# EAGLE schematic 96_Parallelism_DB_Yamaichi_Rev1.2 (EAGLE 9.5.2)
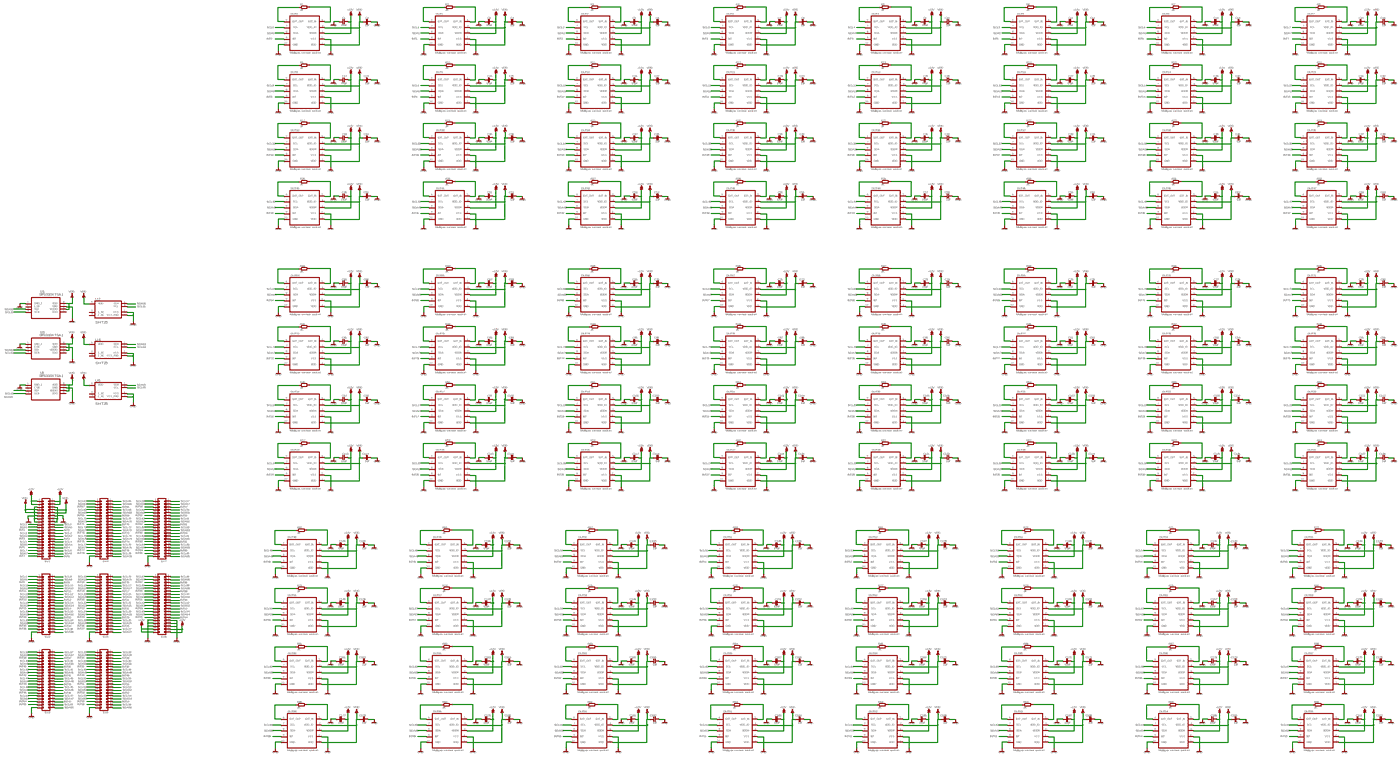
[diagram p0: schematic, sheet 1, overview]
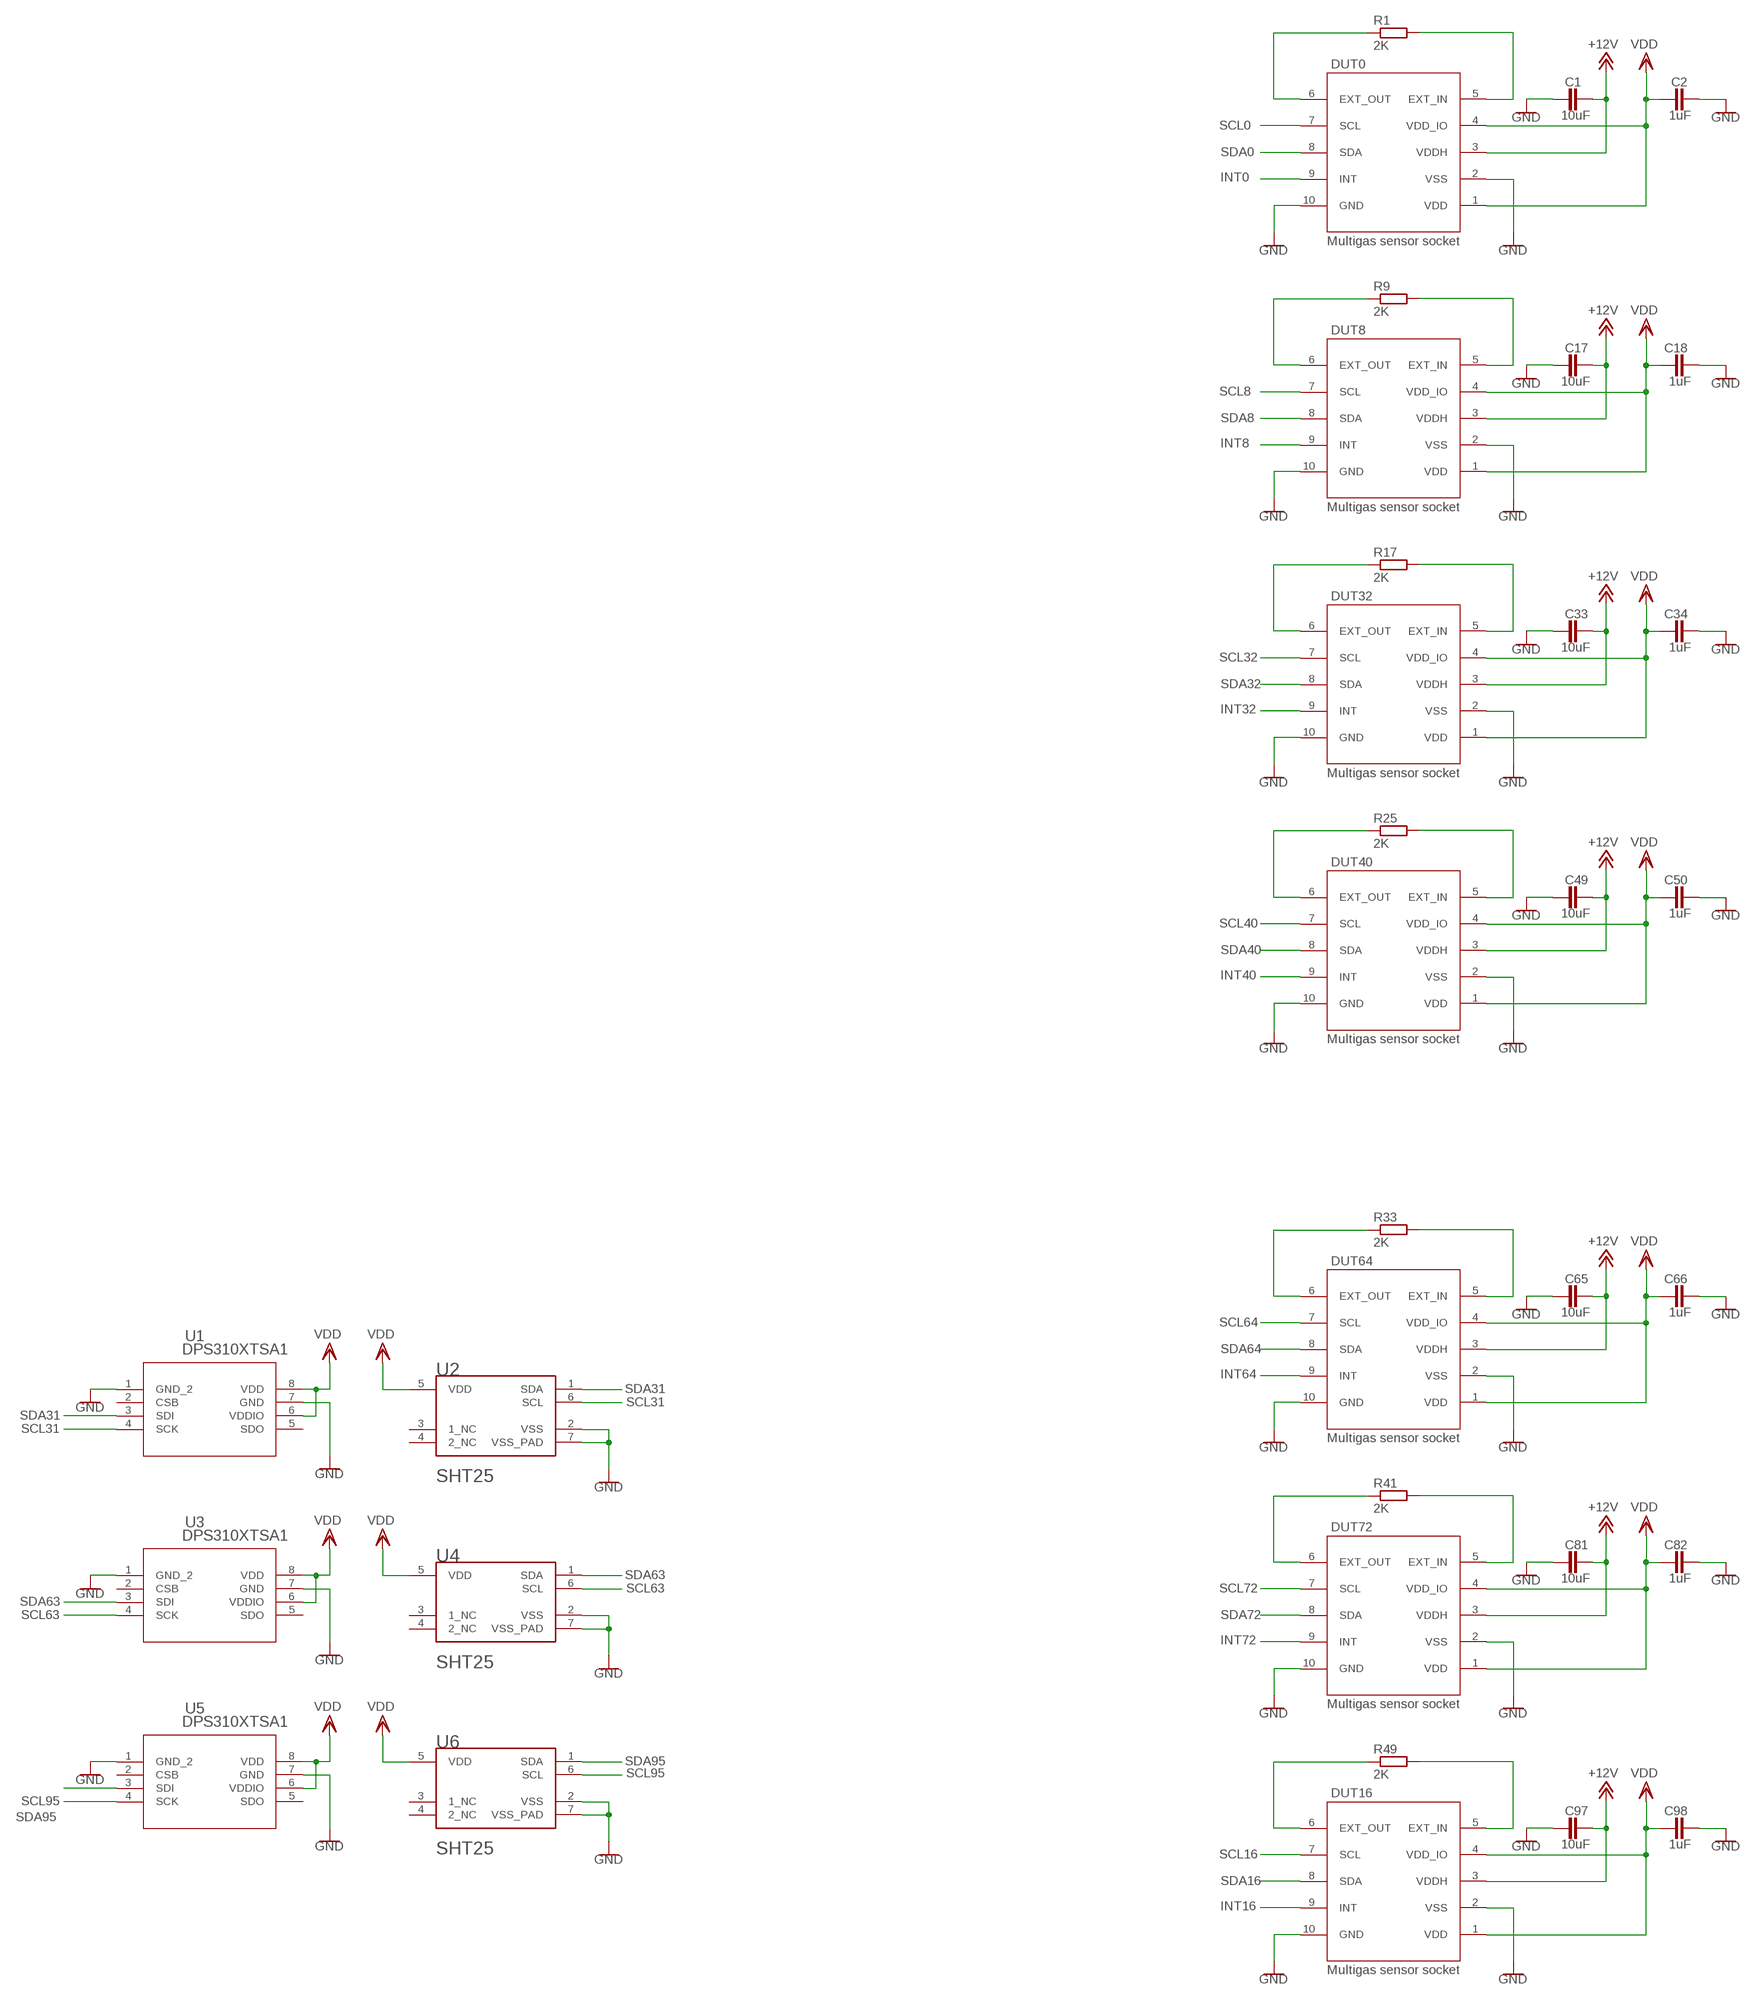
[diagram p1: schematic, sheet 1, part 1 of 8]
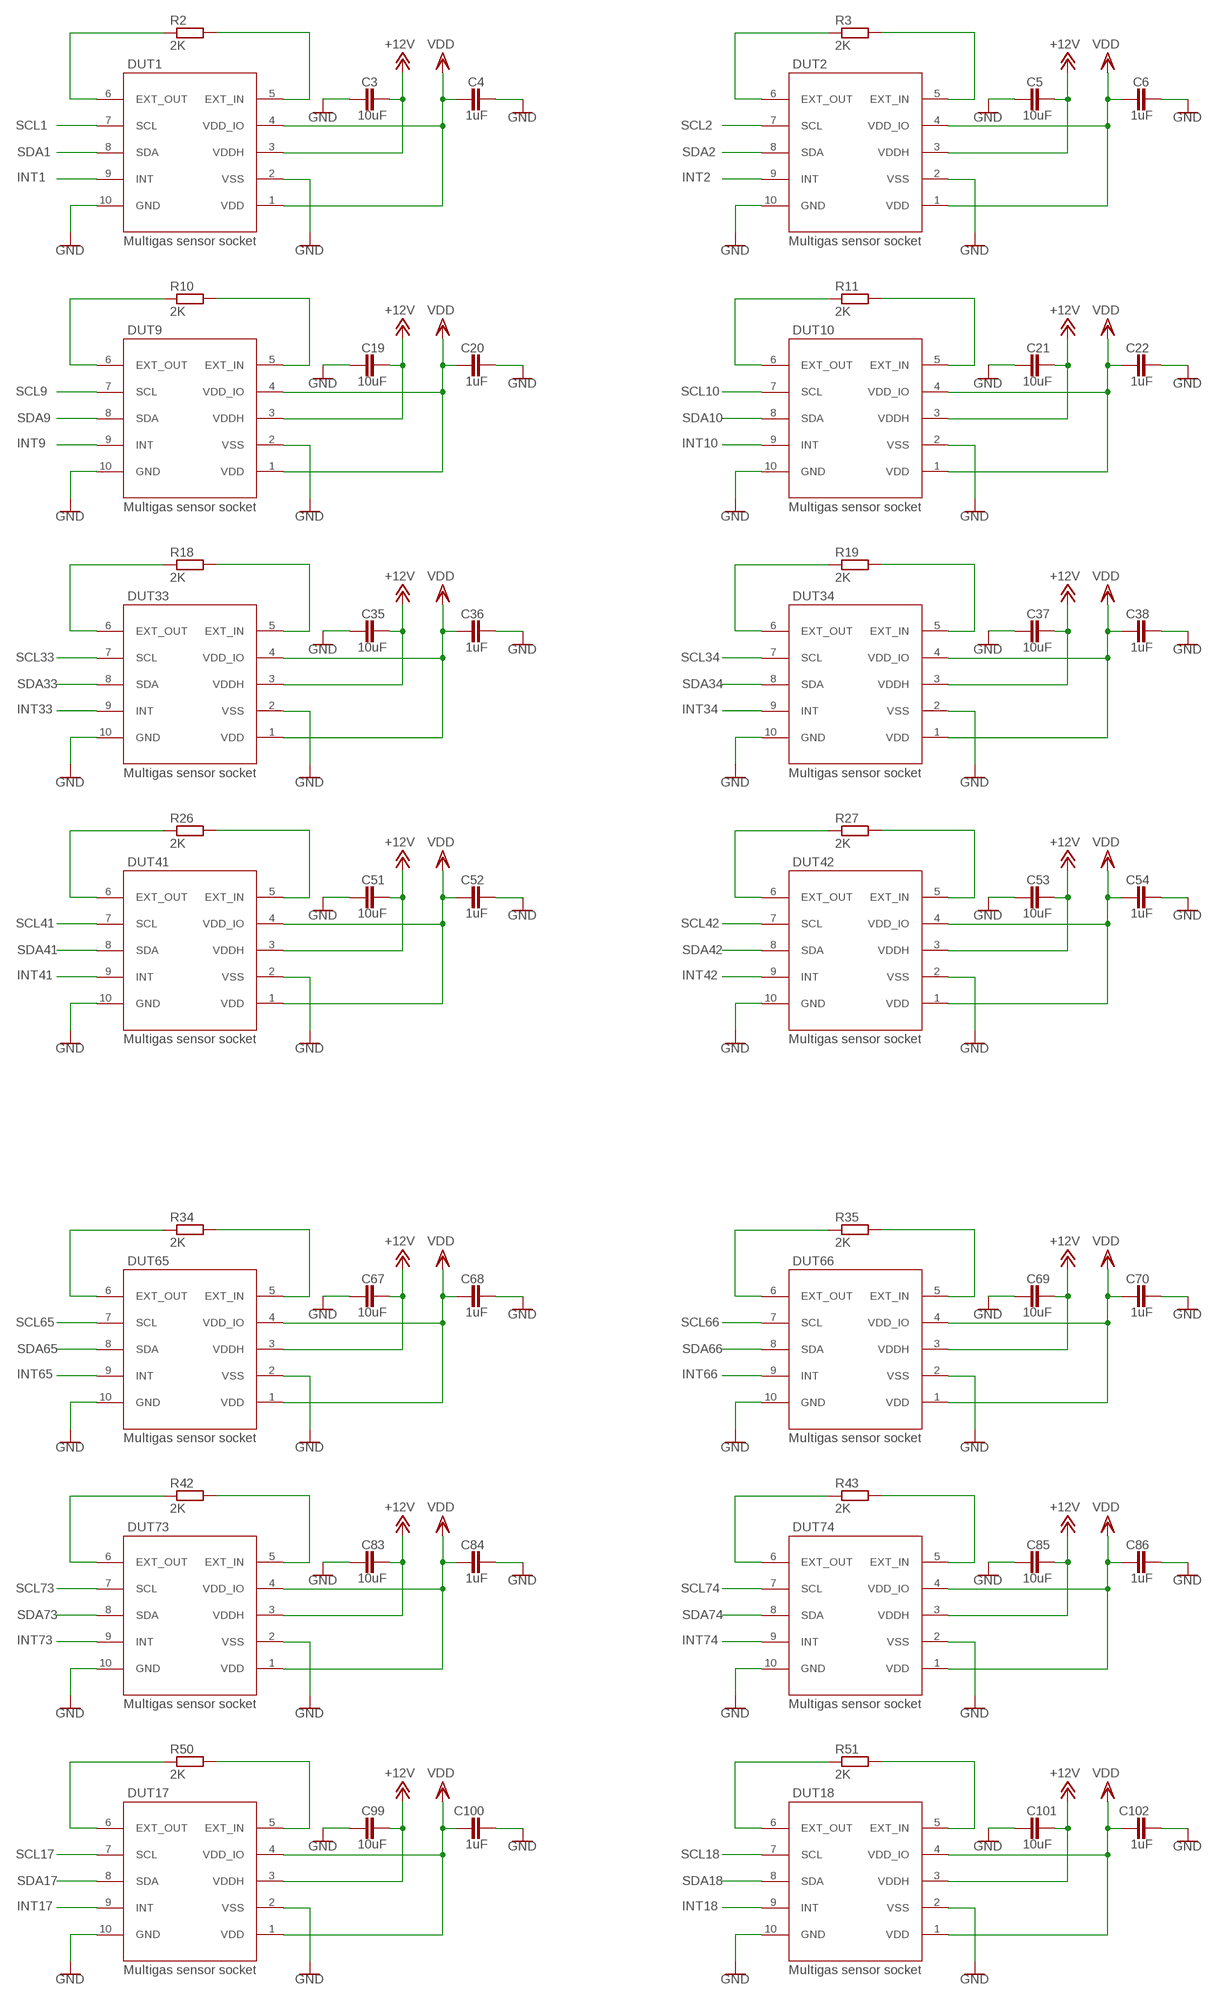
[diagram p2: schematic, sheet 1, part 2 of 8]
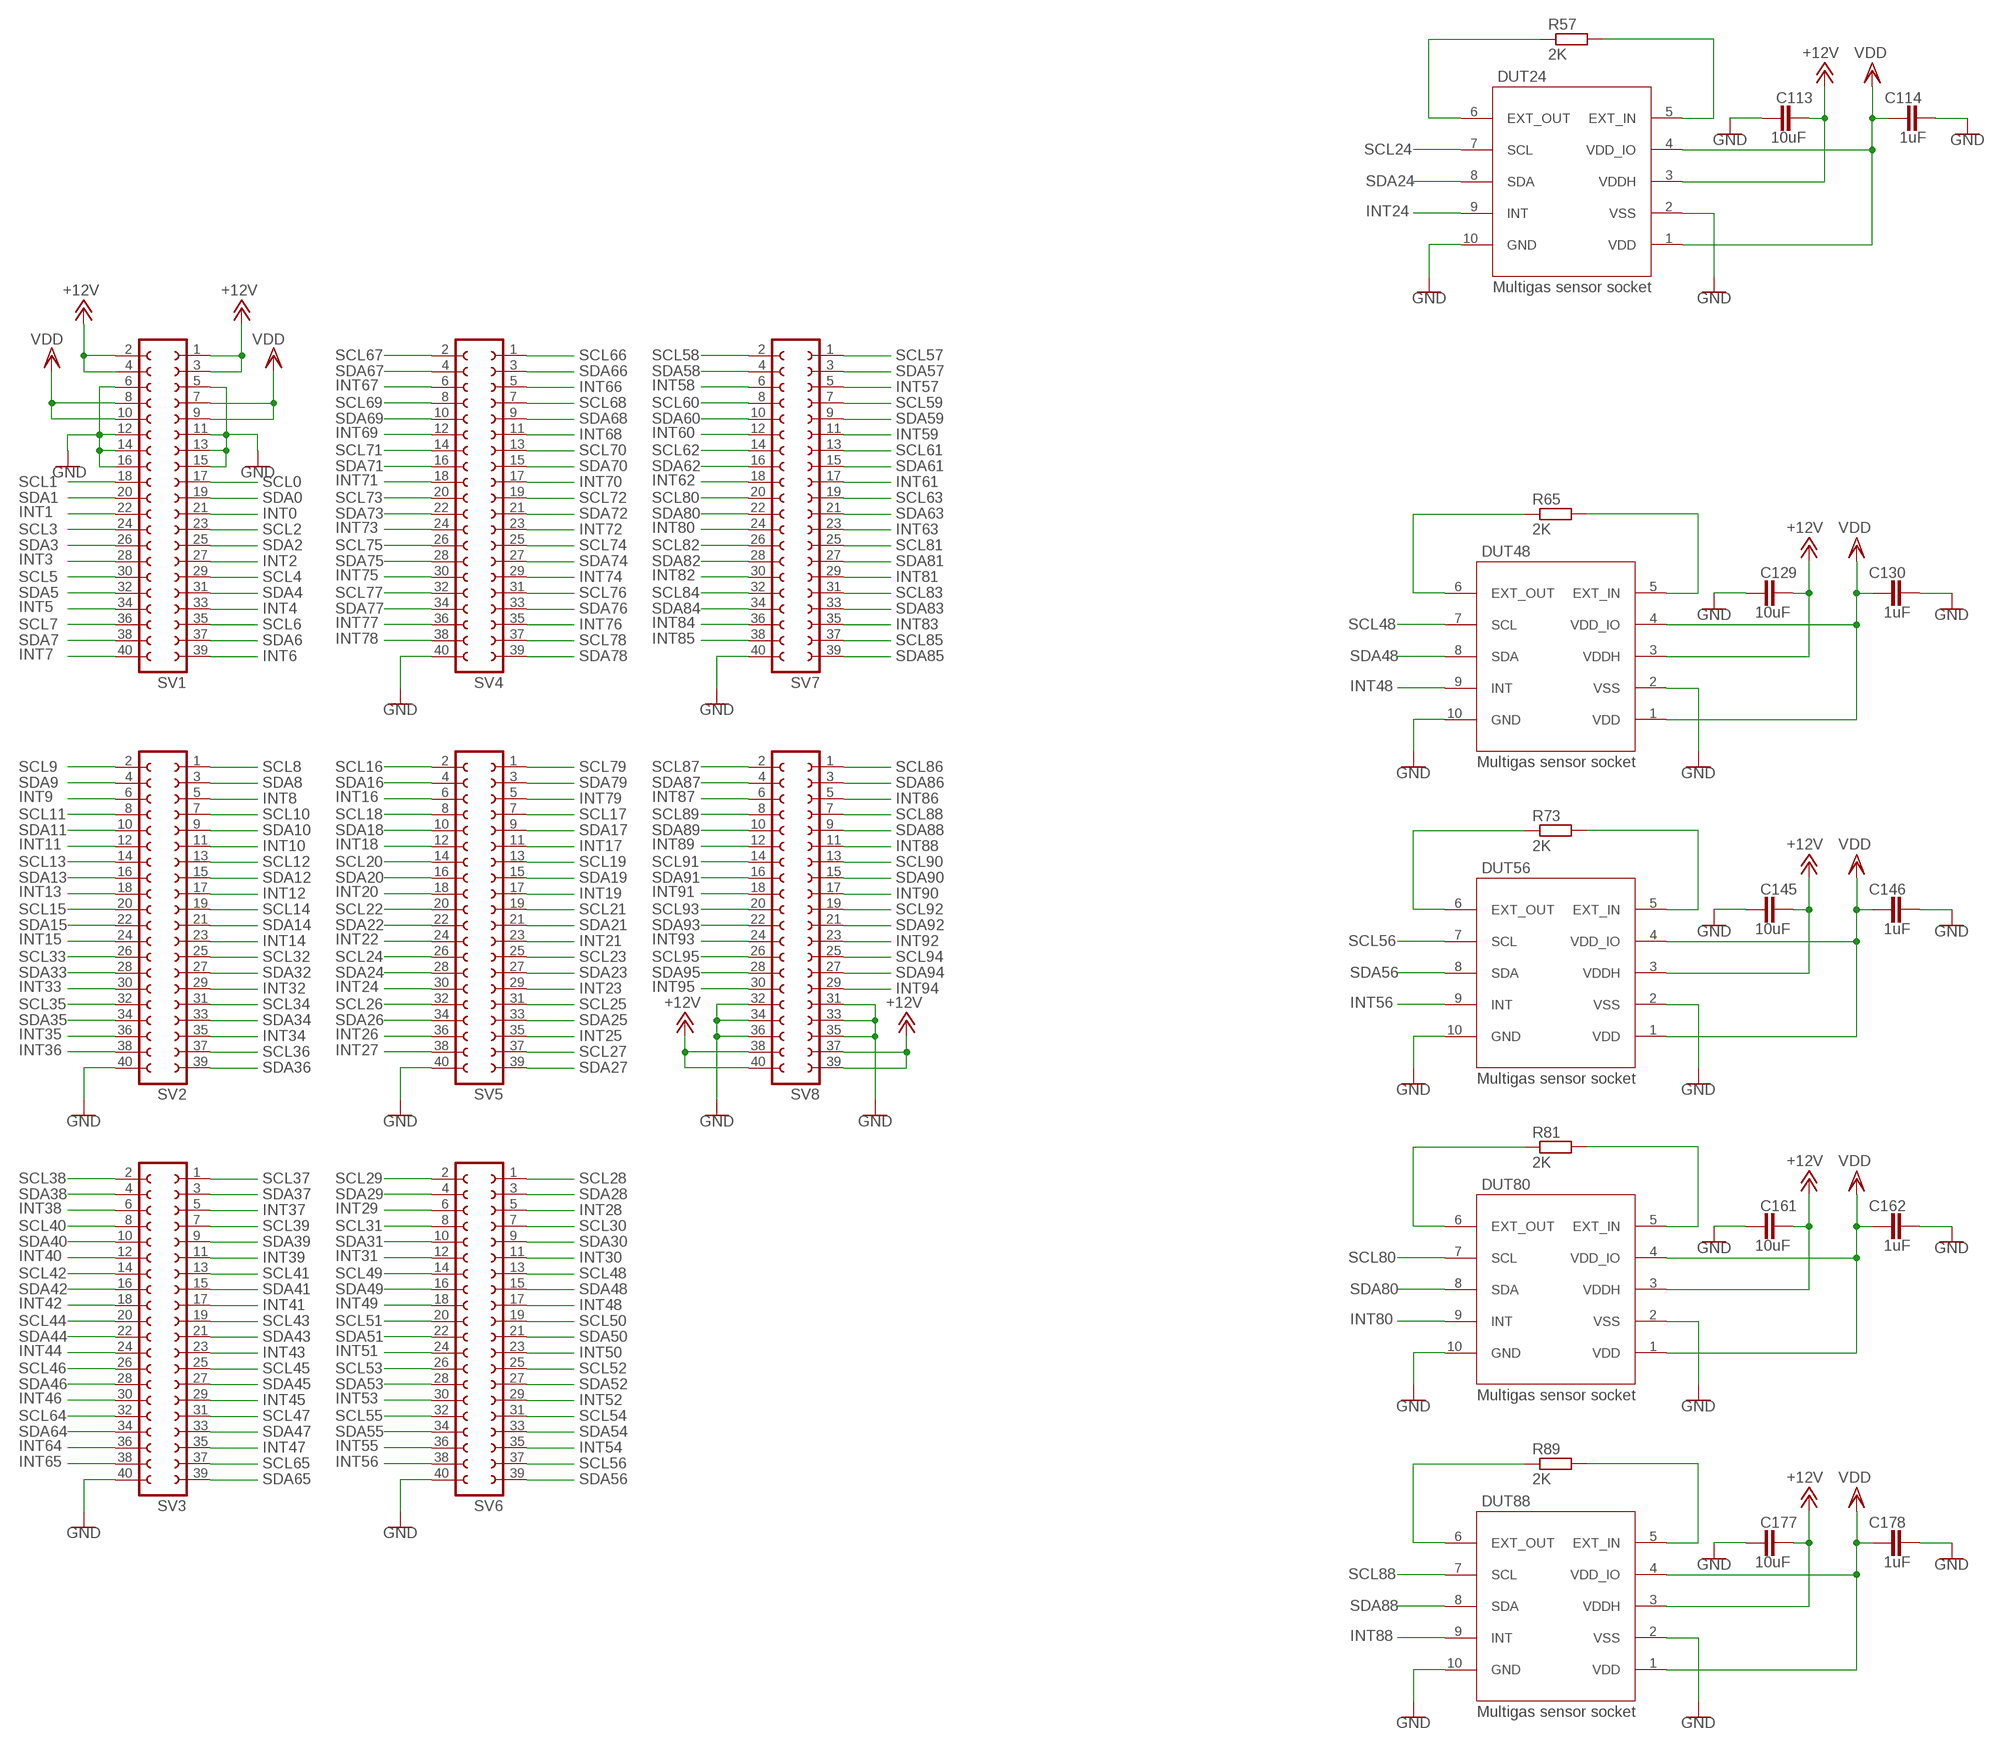
[diagram p3: schematic, sheet 1, part 3 of 8]
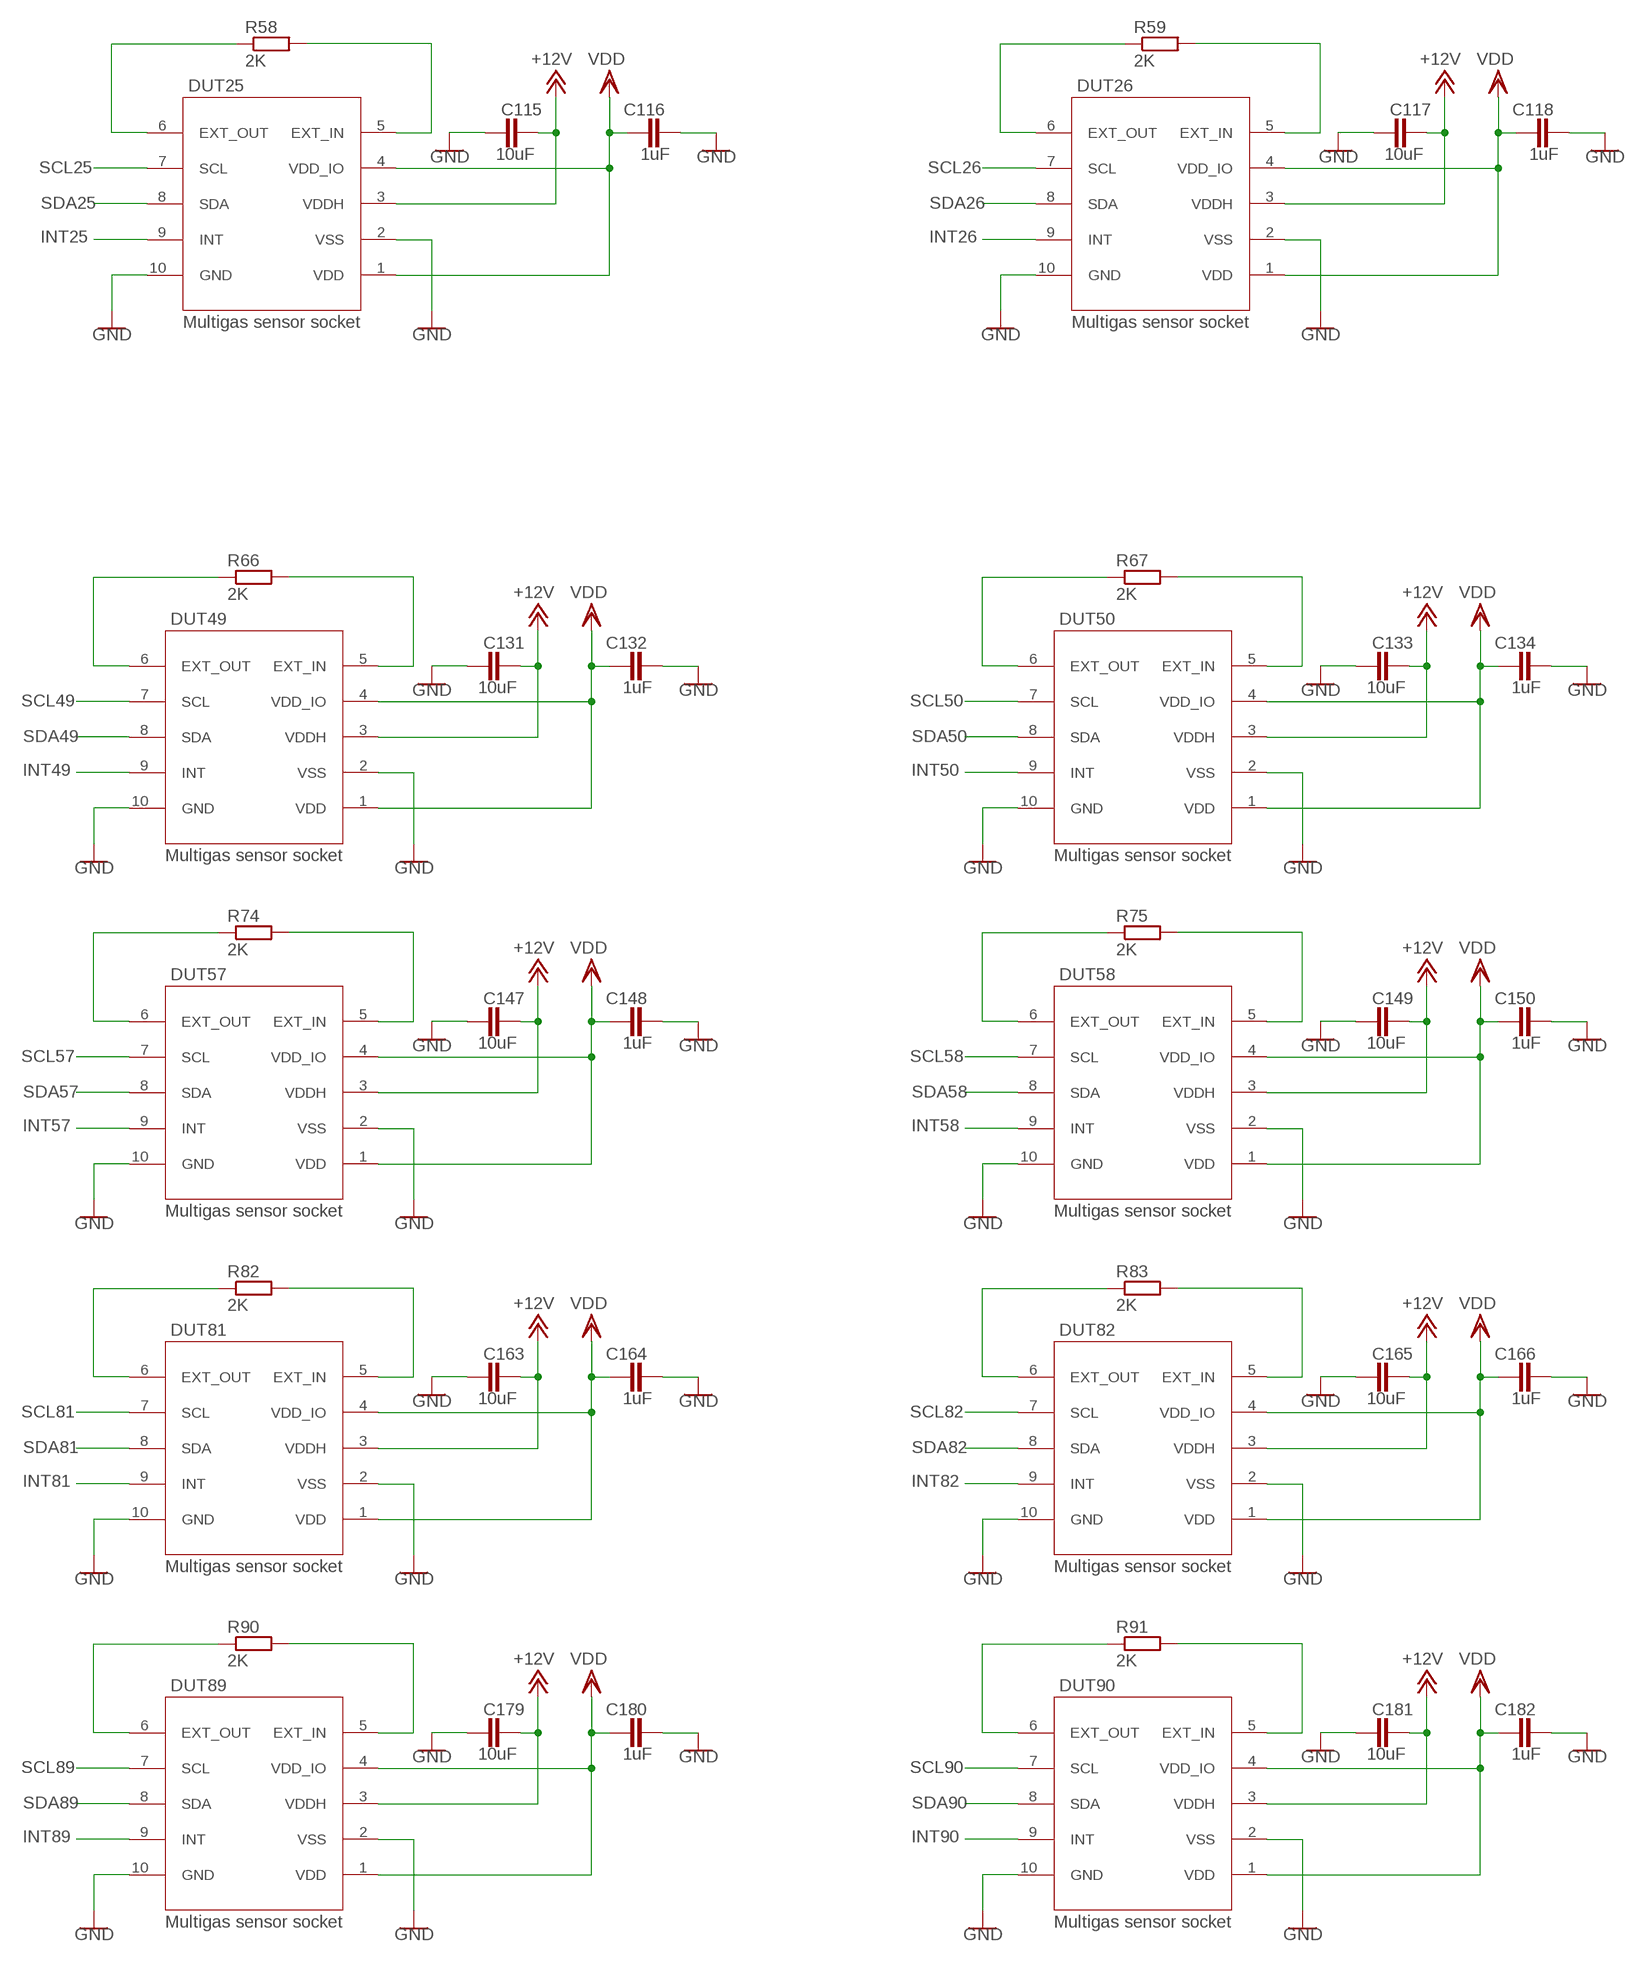
[diagram p4: schematic, sheet 1, part 4 of 8]
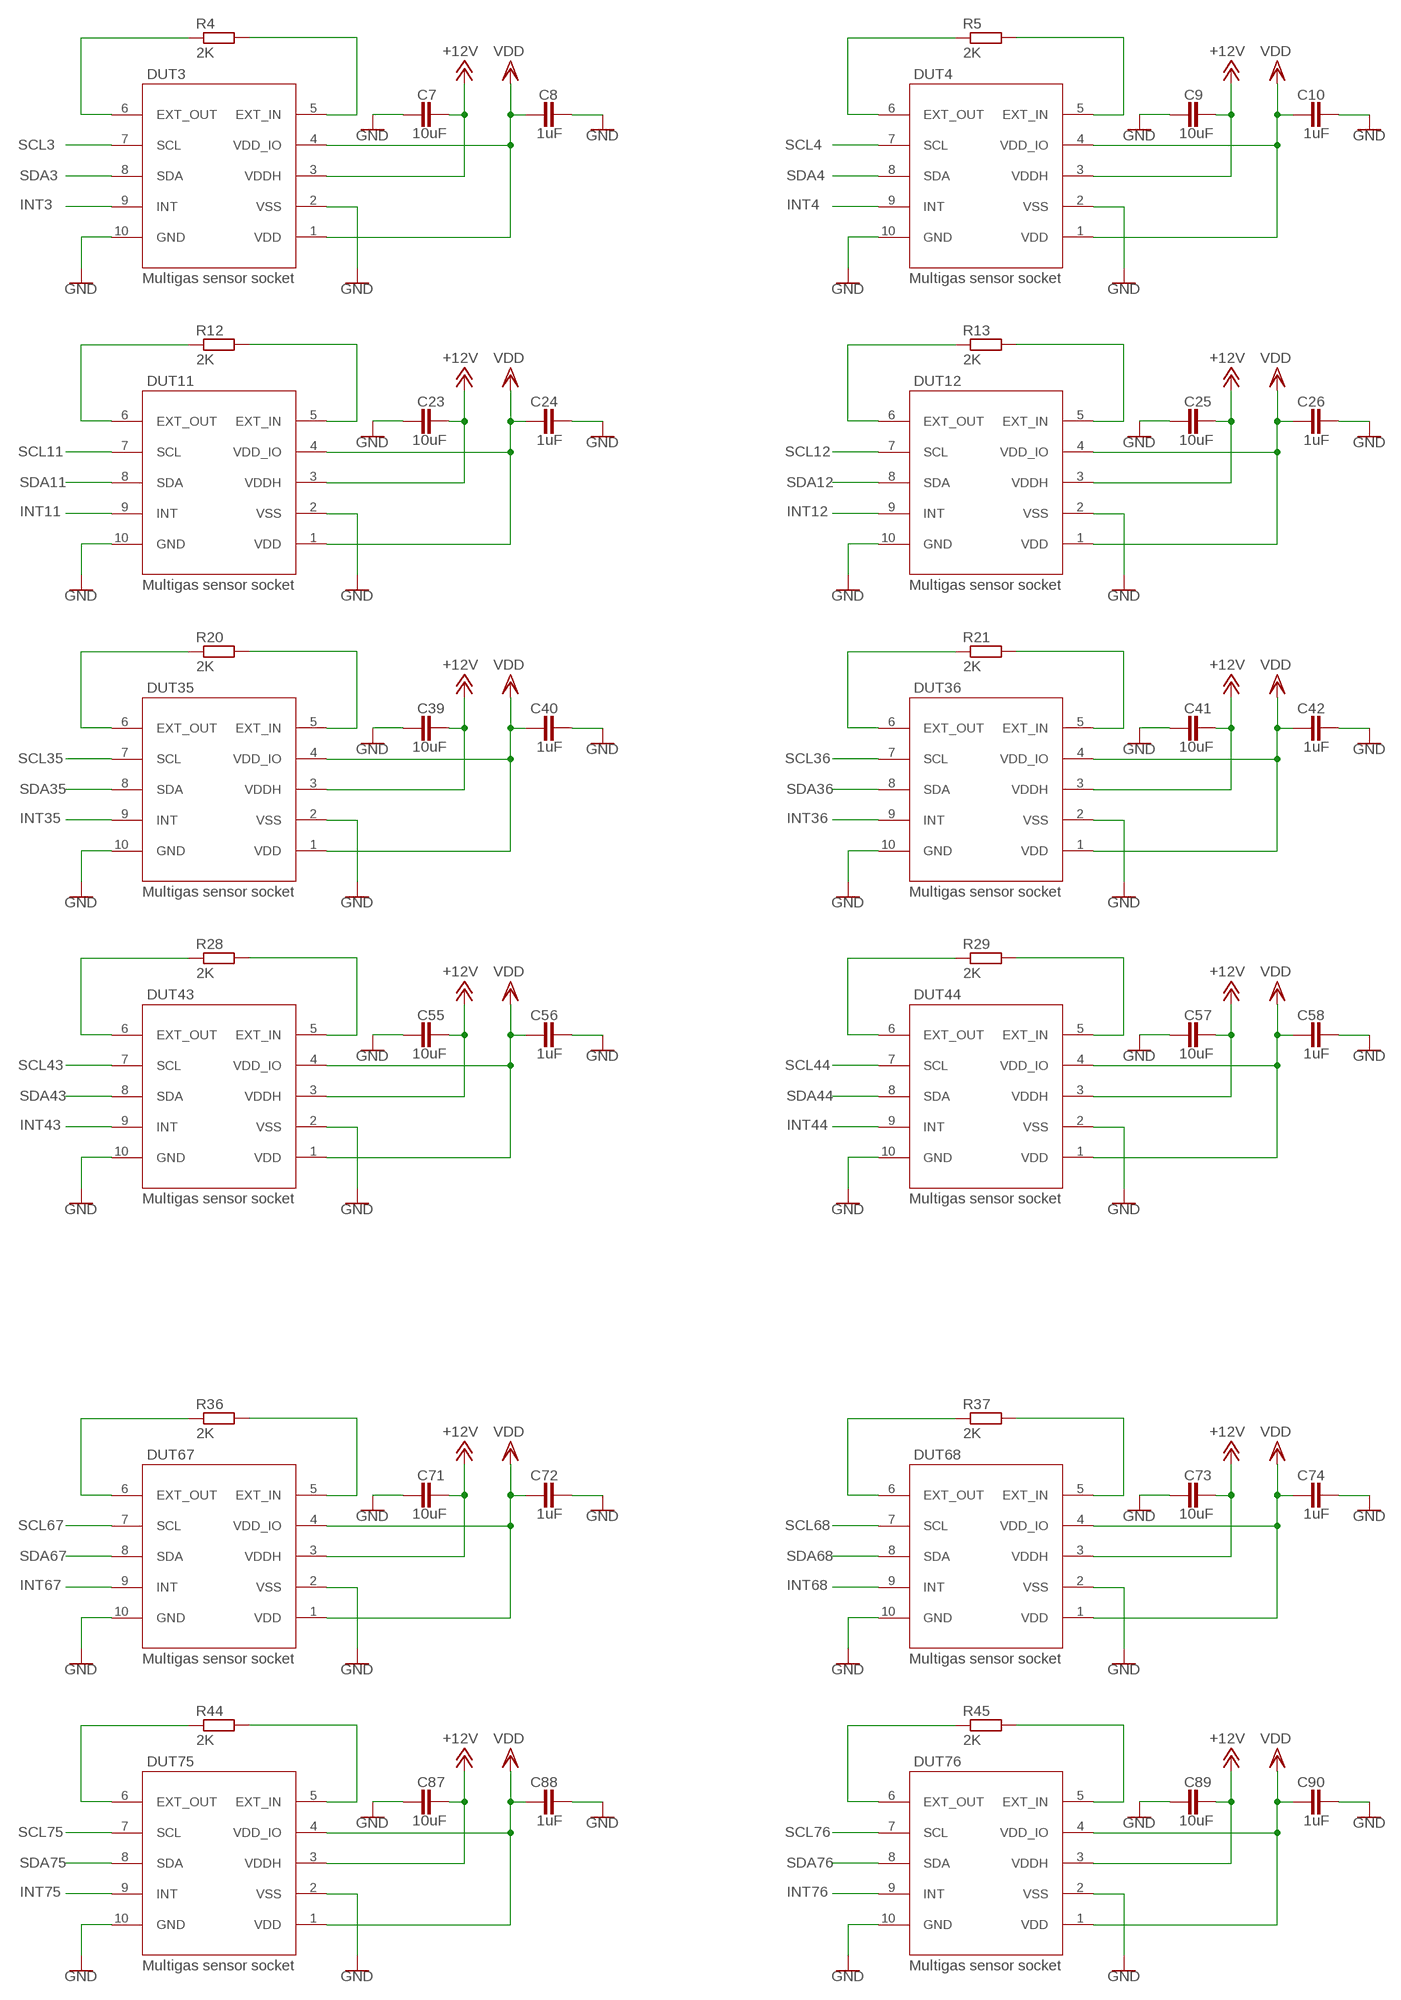
[diagram p5: schematic, sheet 1, part 5 of 8]
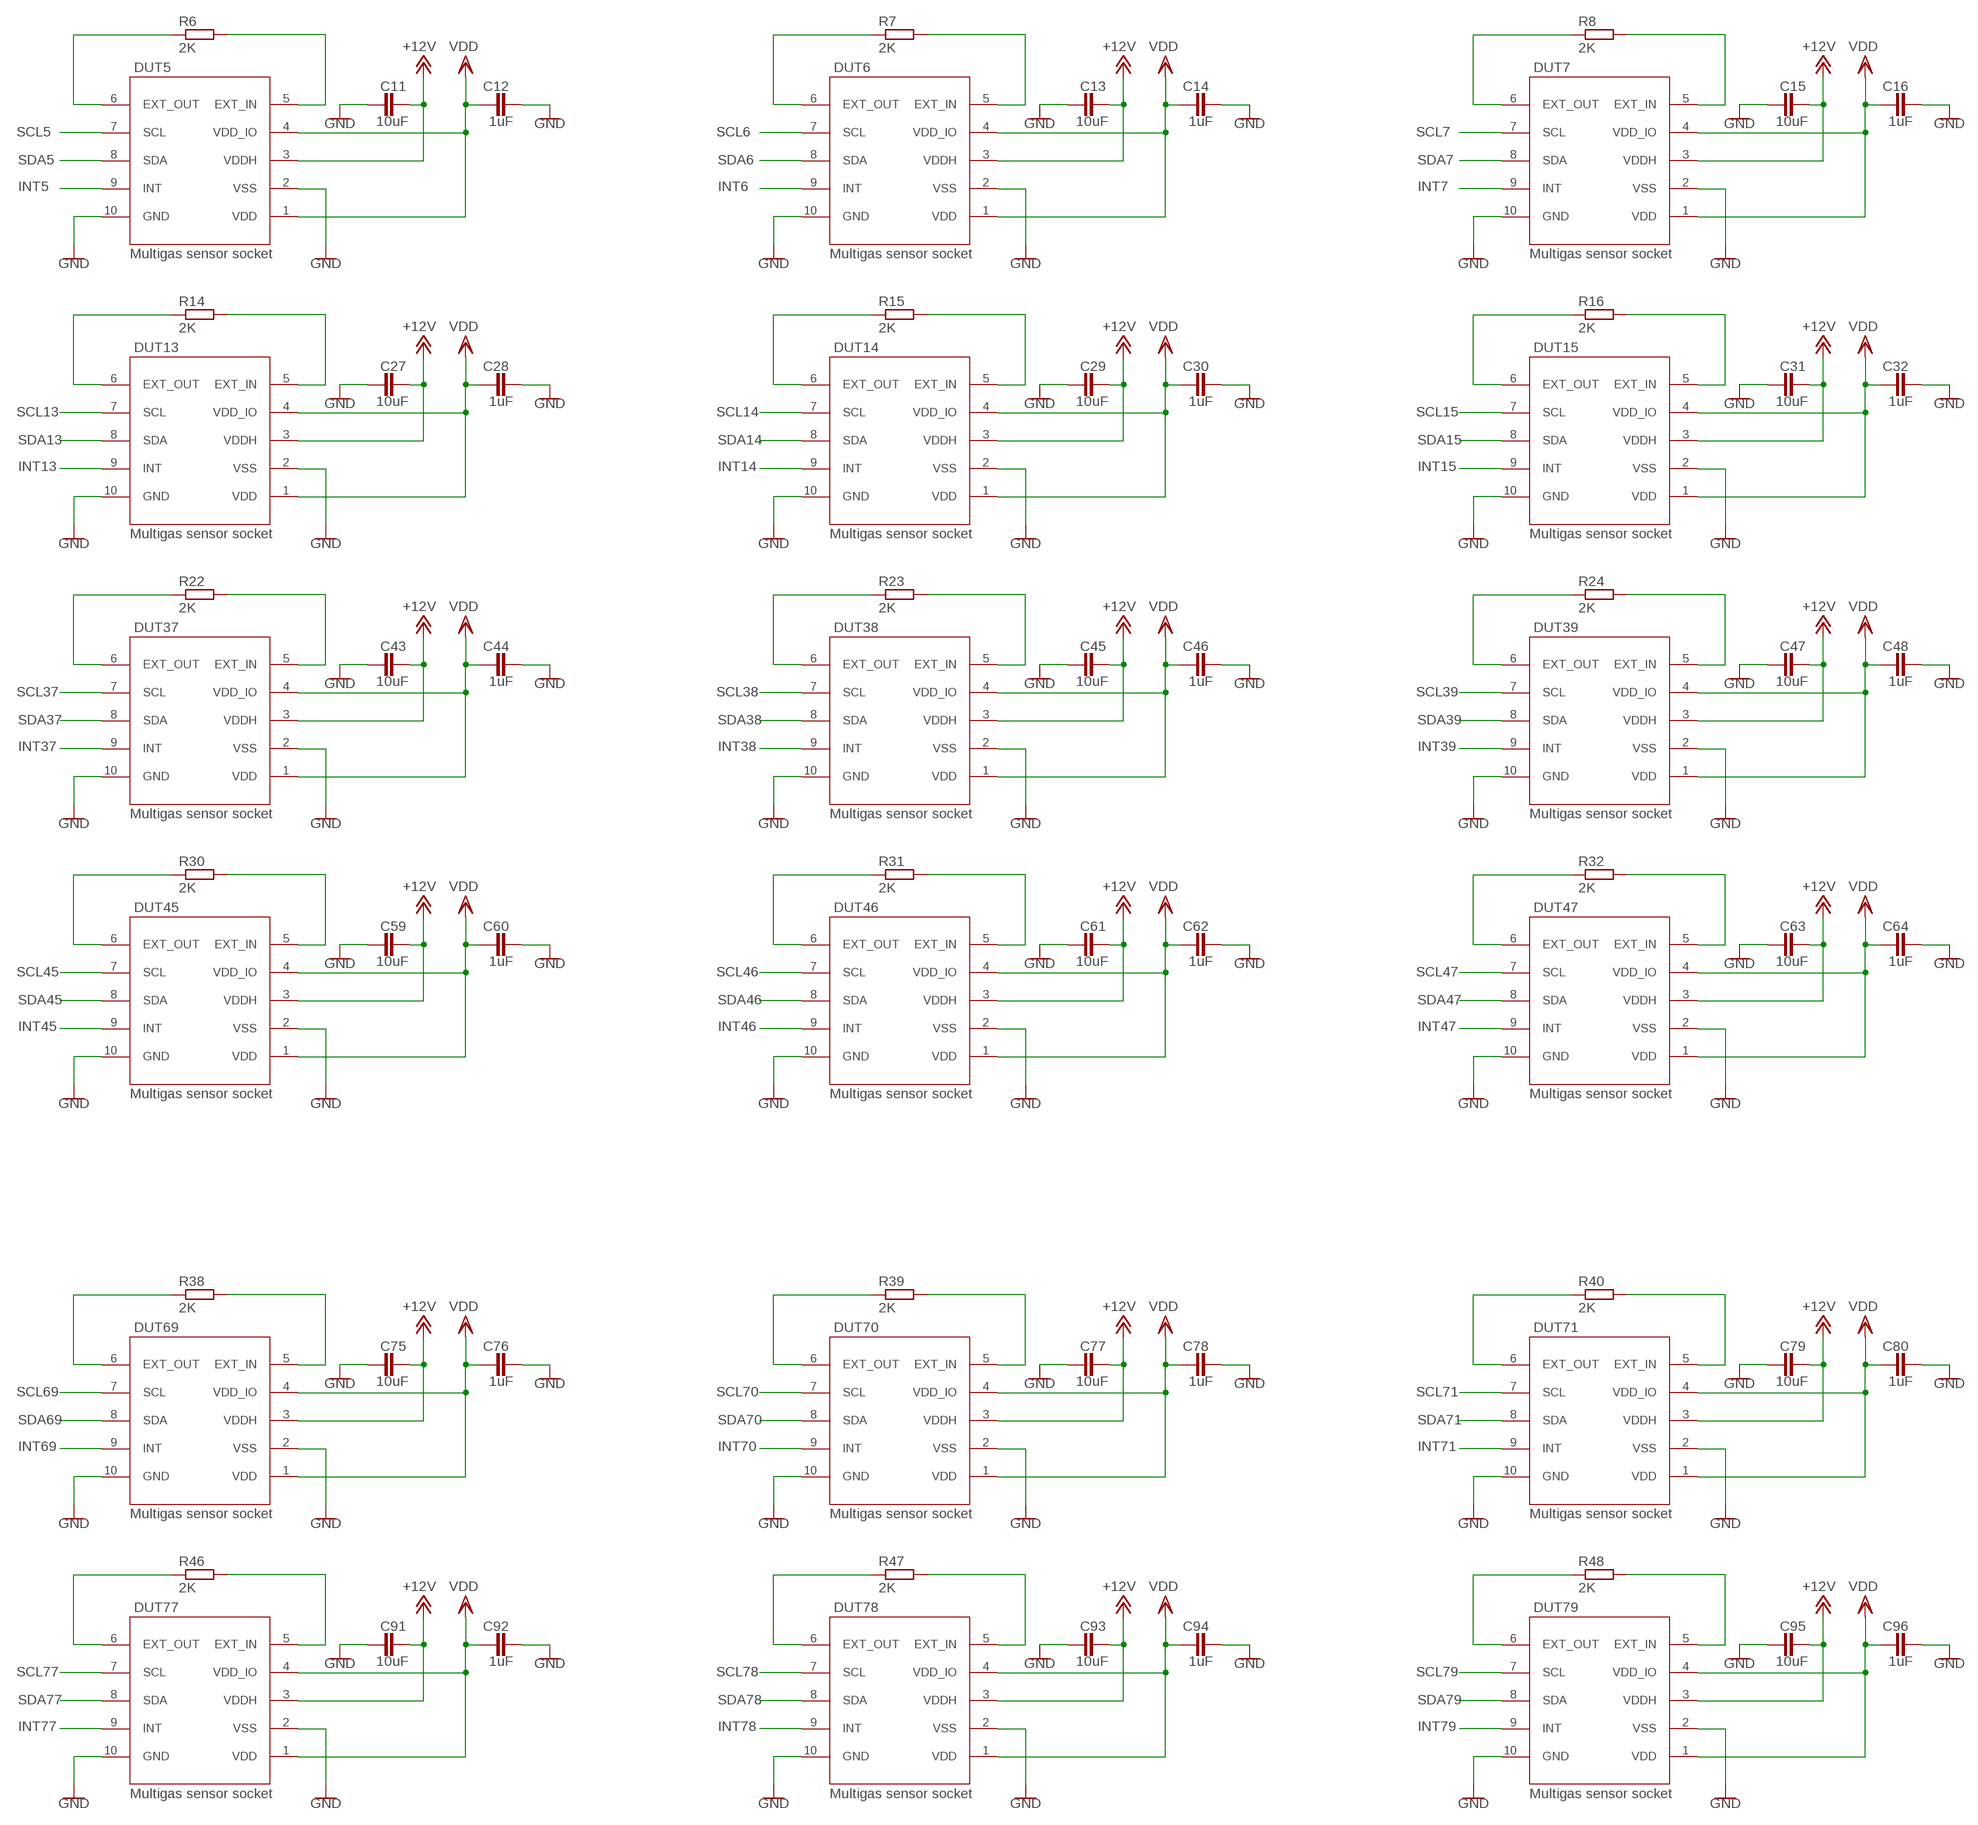
[diagram p6: schematic, sheet 1, part 6 of 8]
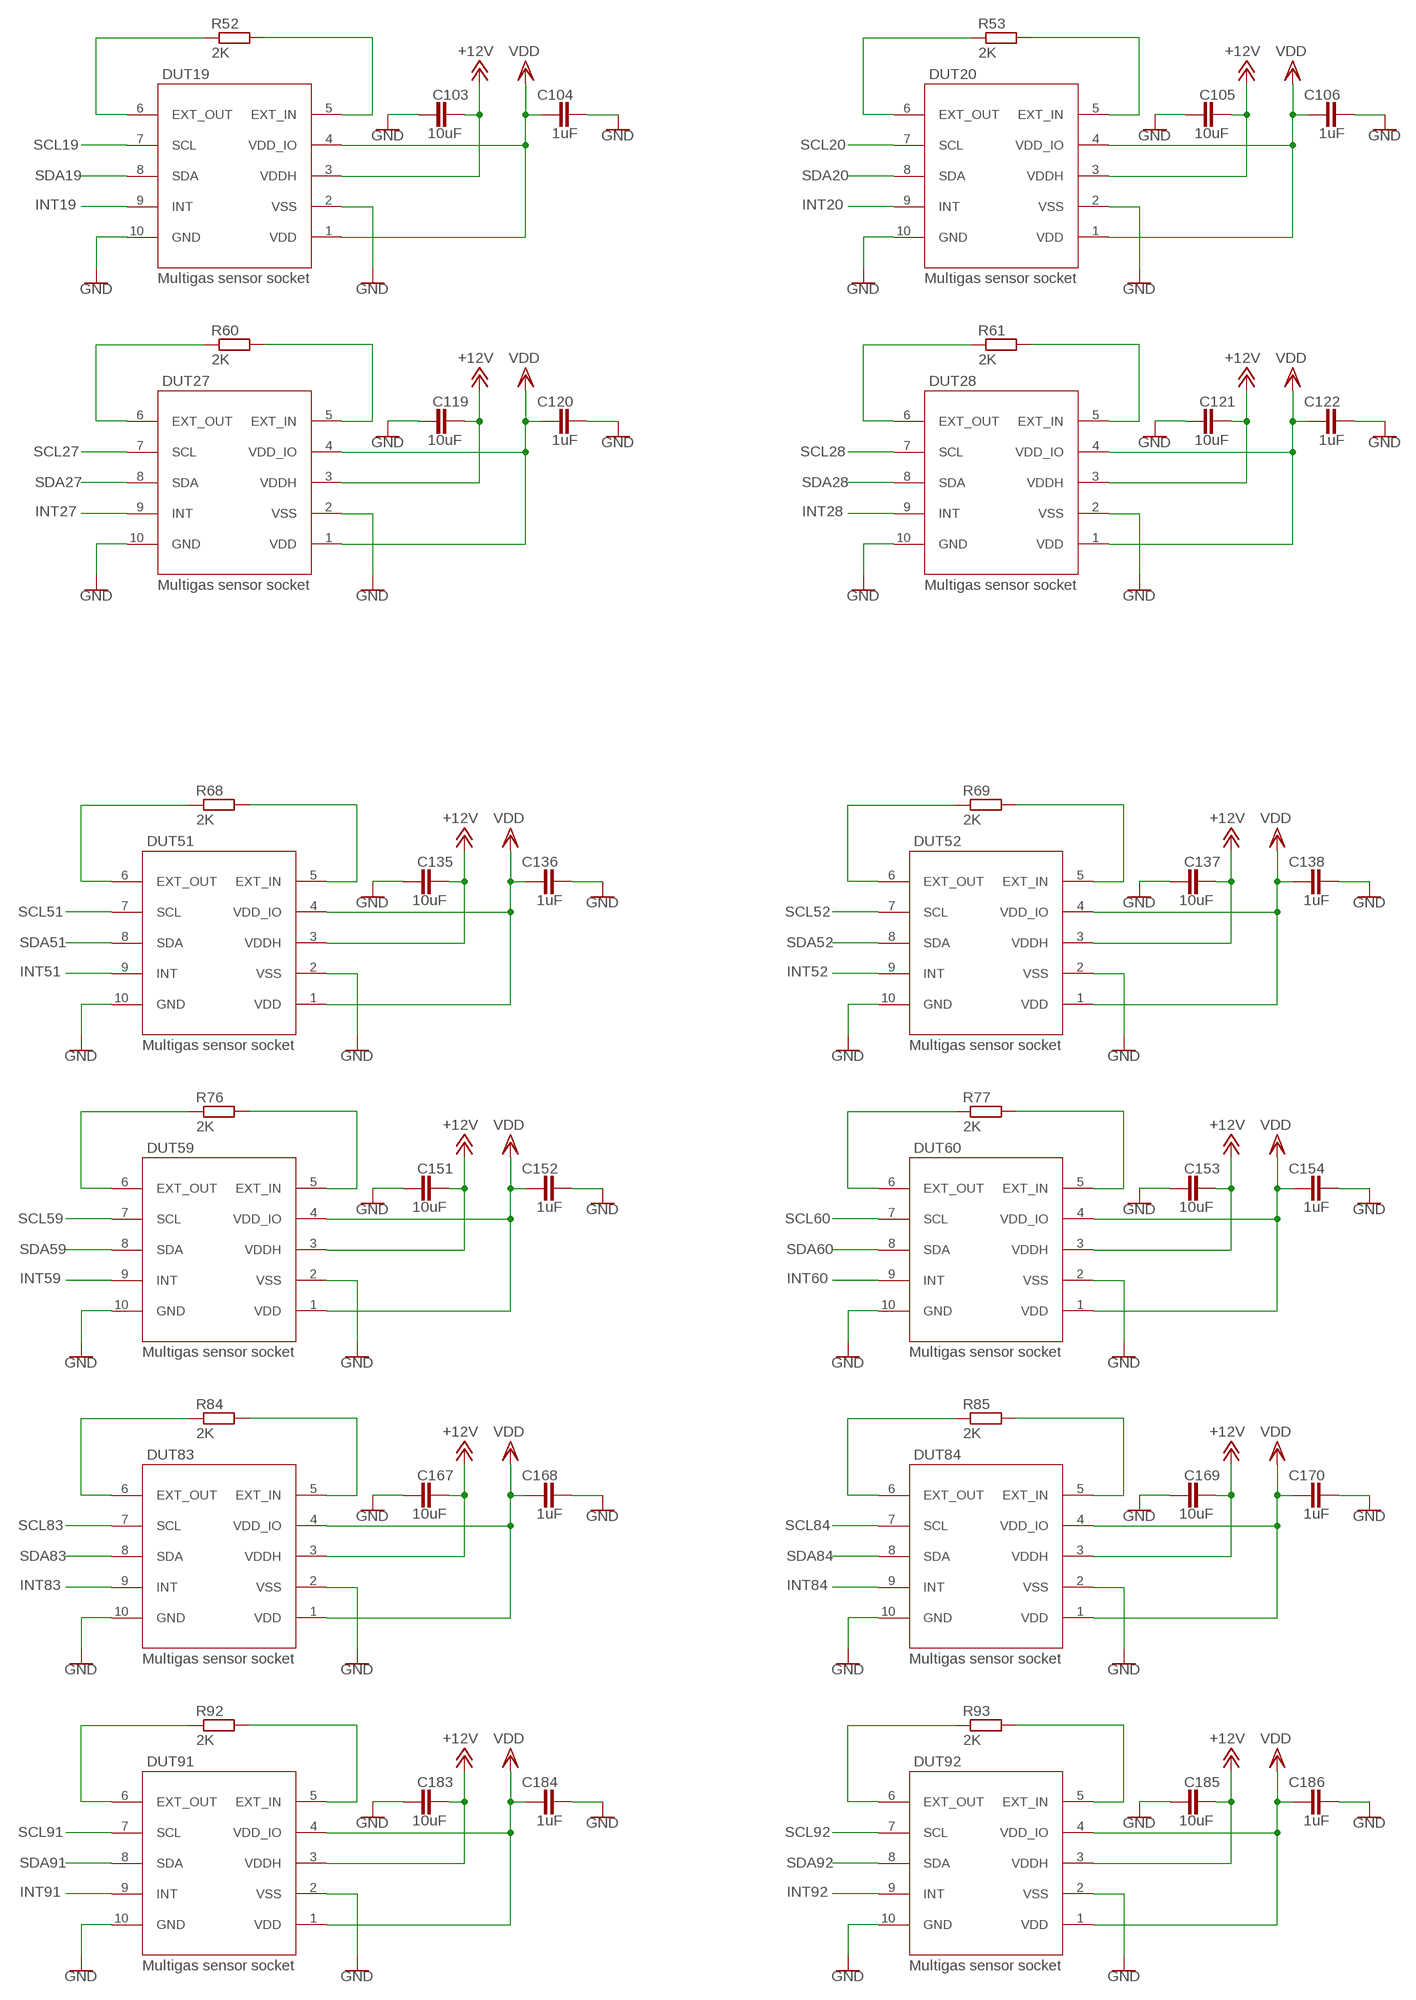
[diagram p7: schematic, sheet 1, part 7 of 8]
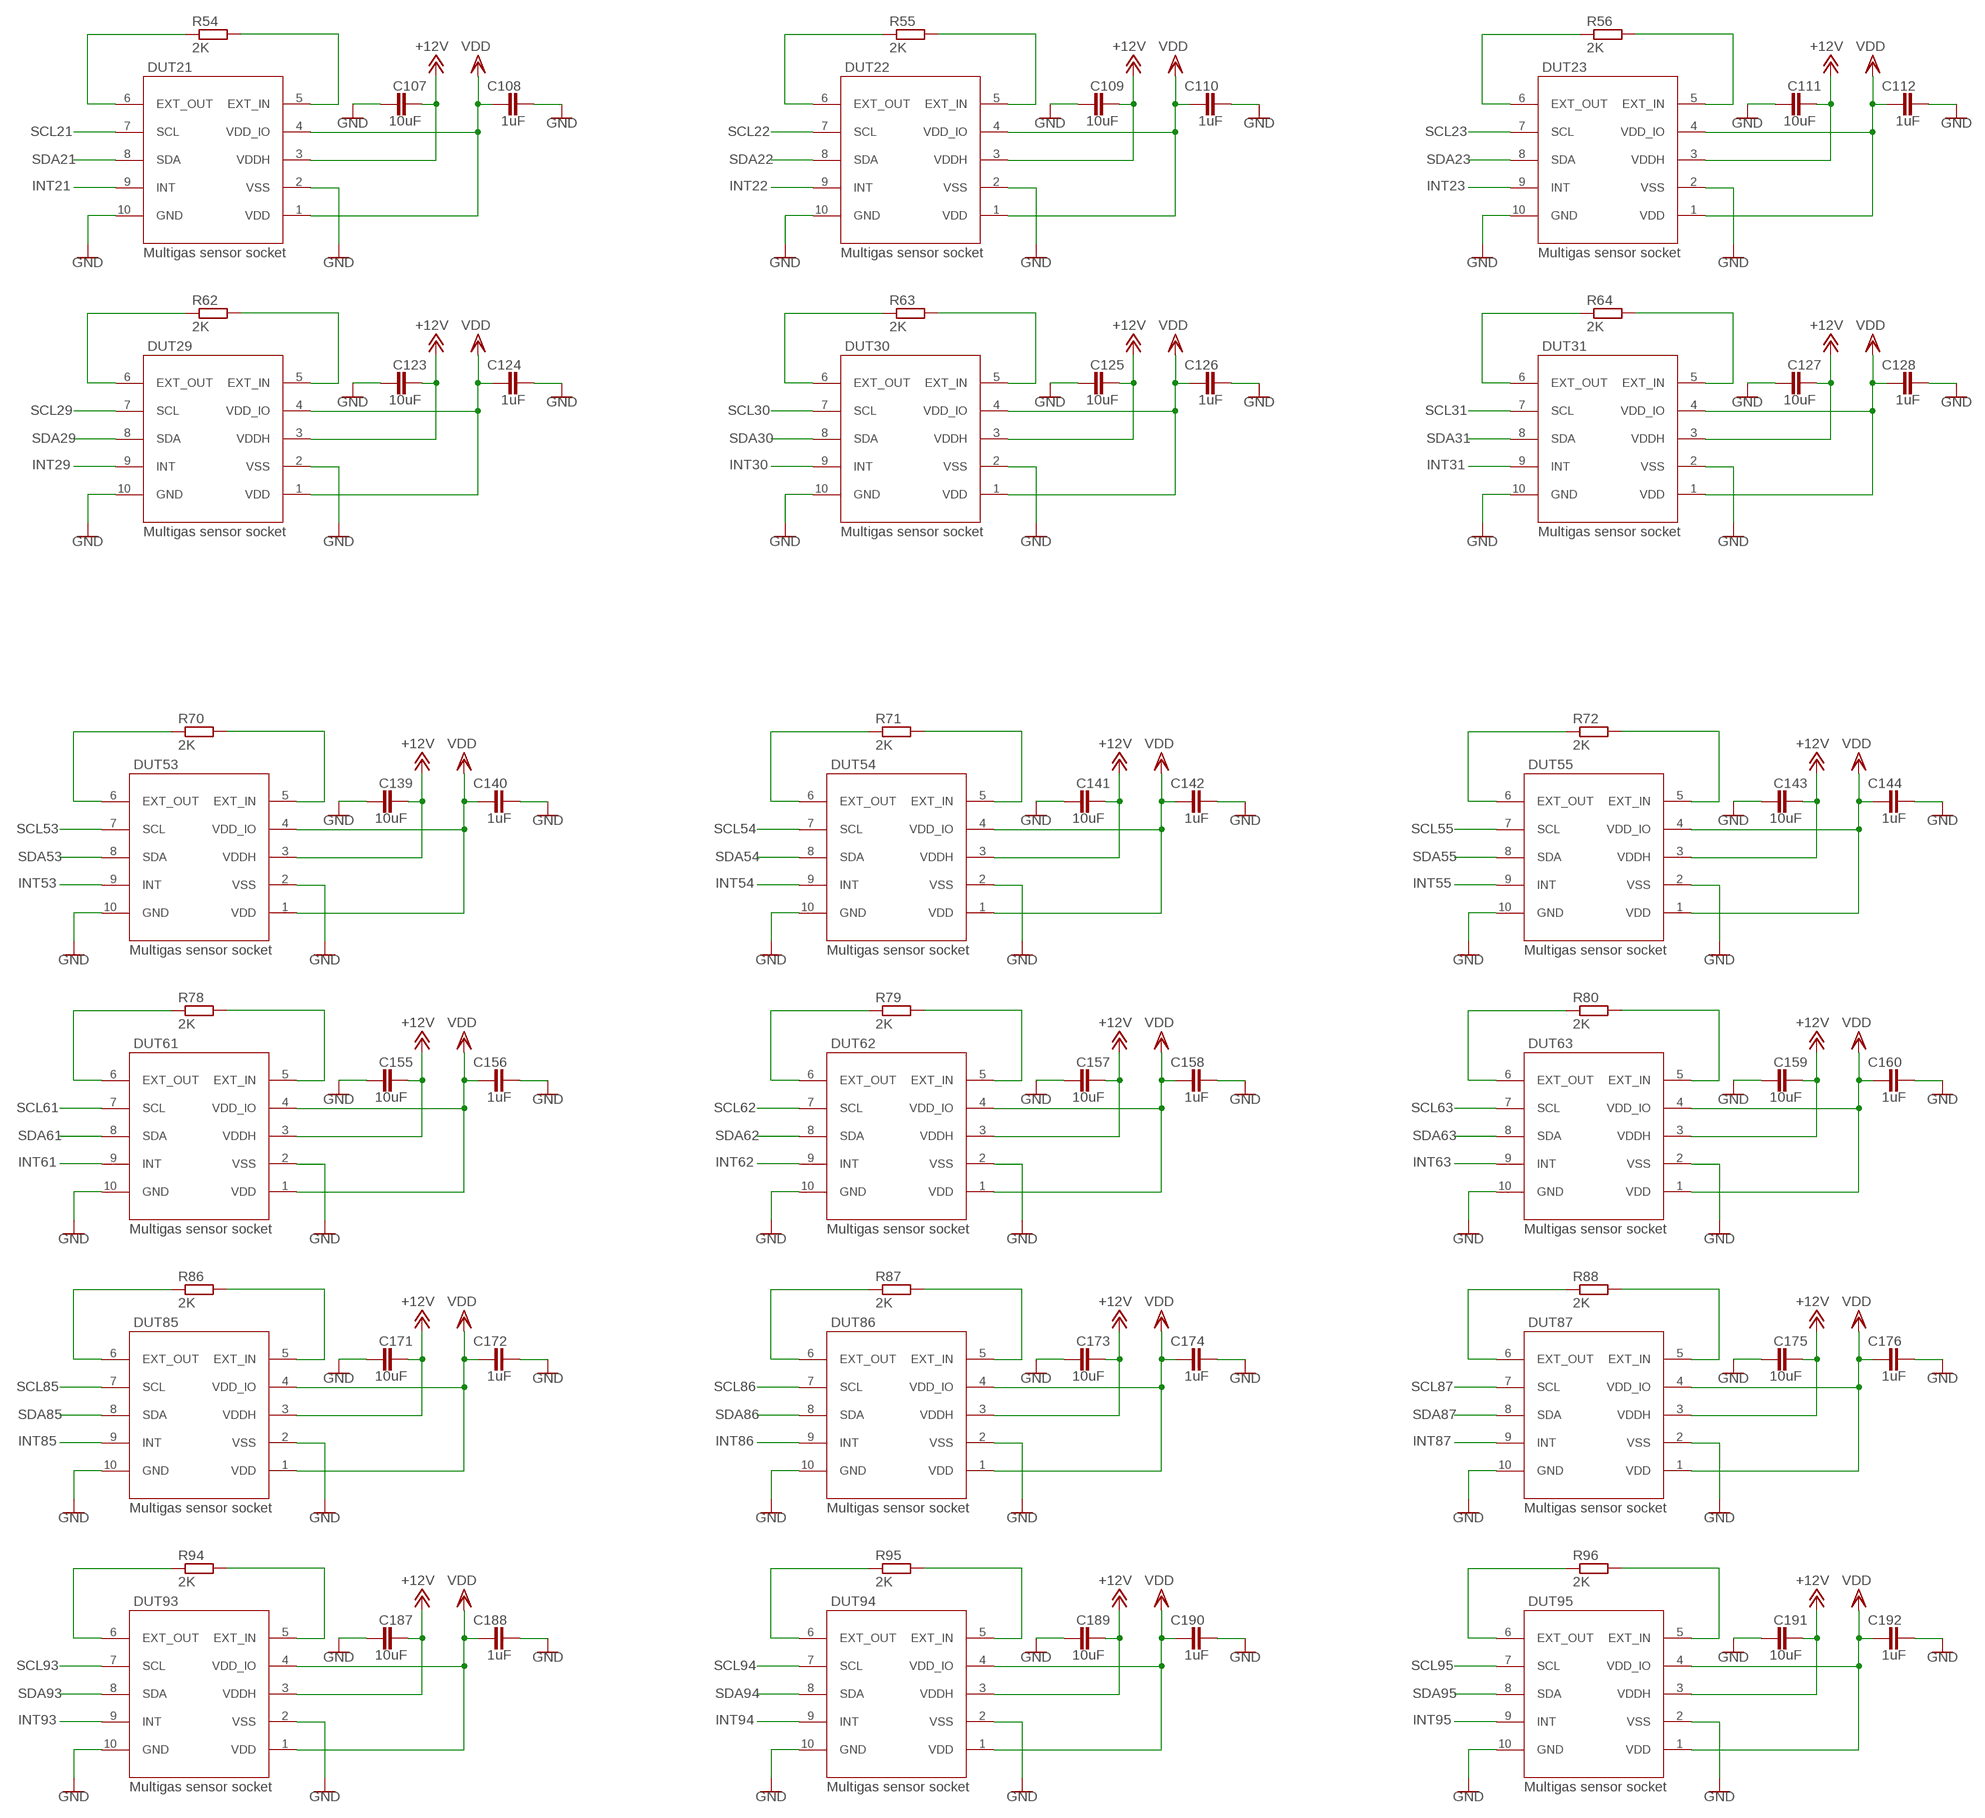
[diagram p8: schematic, sheet 1, part 8 of 8]

## Parts
C1  10uF  C-EUC0805  [C0805]
C2  1uF  C-EUC0805  [C0805]
C3  10uF  C-EUC0805  [C0805]
C4  1uF  C-EUC0805  [C0805]
C5  10uF  C-EUC0805  [C0805]
C6  1uF  C-EUC0805  [C0805]
C7  10uF  C-EUC0805  [C0805]
C8  1uF  C-EUC0805  [C0805]
C9  10uF  C-EUC0805  [C0805]
C10  1uF  C-EUC0805  [C0805]
C11  10uF  C-EUC0805  [C0805]
C12  1uF  C-EUC0805  [C0805]
C13  10uF  C-EUC0805  [C0805]
C14  1uF  C-EUC0805  [C0805]
C15  10uF  C-EUC0805  [C0805]
C16  1uF  C-EUC0805  [C0805]
C17  10uF  C-EUC0805  [C0805]
C18  1uF  C-EUC0805  [C0805]
C19  10uF  C-EUC0805  [C0805]
C20  1uF  C-EUC0805  [C0805]
C21  10uF  C-EUC0805  [C0805]
C22  1uF  C-EUC0805  [C0805]
C23  10uF  C-EUC0805  [C0805]
C24  1uF  C-EUC0805  [C0805]
C25  10uF  C-EUC0805  [C0805]
C26  1uF  C-EUC0805  [C0805]
C27  10uF  C-EUC0805  [C0805]
C28  1uF  C-EUC0805  [C0805]
C29  10uF  C-EUC0805  [C0805]
C30  1uF  C-EUC0805  [C0805]
C31  10uF  C-EUC0805  [C0805]
C32  1uF  C-EUC0805  [C0805]
C33  10uF  C-EUC0805  [C0805]
C34  1uF  C-EUC0805  [C0805]
C35  10uF  C-EUC0805  [C0805]
C36  1uF  C-EUC0805  [C0805]
C37  10uF  C-EUC0805  [C0805]
C38  1uF  C-EUC0805  [C0805]
C39  10uF  C-EUC0805  [C0805]
C40  1uF  C-EUC0805  [C0805]
C41  10uF  C-EUC0805  [C0805]
C42  1uF  C-EUC0805  [C0805]
C43  10uF  C-EUC0805  [C0805]
C44  1uF  C-EUC0805  [C0805]
C45  10uF  C-EUC0805  [C0805]
C46  1uF  C-EUC0805  [C0805]
C47  10uF  C-EUC0805  [C0805]
C48  1uF  C-EUC0805  [C0805]
C49  10uF  C-EUC0805  [C0805]
C50  1uF  C-EUC0805  [C0805]
C51  10uF  C-EUC0805  [C0805]
C52  1uF  C-EUC0805  [C0805]
C53  10uF  C-EUC0805  [C0805]
C54  1uF  C-EUC0805  [C0805]
C55  10uF  C-EUC0805  [C0805]
C56  1uF  C-EUC0805  [C0805]
C57  10uF  C-EUC0805  [C0805]
C58  1uF  C-EUC0805  [C0805]
C59  10uF  C-EUC0805  [C0805]
C60  1uF  C-EUC0805  [C0805]
C61  10uF  C-EUC0805  [C0805]
C62  1uF  C-EUC0805  [C0805]
C63  10uF  C-EUC0805  [C0805]
C64  1uF  C-EUC0805  [C0805]
C65  10uF  C-EUC0805  [C0805]
C66  1uF  C-EUC0805  [C0805]
C67  10uF  C-EUC0805  [C0805]
C68  1uF  C-EUC0805  [C0805]
C69  10uF  C-EUC0805  [C0805]
C70  1uF  C-EUC0805  [C0805]
C71  10uF  C-EUC0805  [C0805]
C72  1uF  C-EUC0805  [C0805]
C73  10uF  C-EUC0805  [C0805]
C74  1uF  C-EUC0805  [C0805]
C75  10uF  C-EUC0805  [C0805]
C76  1uF  C-EUC0805  [C0805]
C77  10uF  C-EUC0805  [C0805]
C78  1uF  C-EUC0805  [C0805]
C79  10uF  C-EUC0805  [C0805]
C80  1uF  C-EUC0805  [C0805]
C81  10uF  C-EUC0805  [C0805]
C82  1uF  C-EUC0805  [C0805]
C83  10uF  C-EUC0805  [C0805]
C84  1uF  C-EUC0805  [C0805]
C85  10uF  C-EUC0805  [C0805]
C86  1uF  C-EUC0805  [C0805]
C87  10uF  C-EUC0805  [C0805]
C88  1uF  C-EUC0805  [C0805]
C89  10uF  C-EUC0805  [C0805]
C90  1uF  C-EUC0805  [C0805]
C91  10uF  C-EUC0805  [C0805]
C92  1uF  C-EUC0805  [C0805]
C93  10uF  C-EUC0805  [C0805]
C94  1uF  C-EUC0805  [C0805]
C95  10uF  C-EUC0805  [C0805]
C96  1uF  C-EUC0805  [C0805]
C97  10uF  C-EUC0805  [C0805]
C98  1uF  C-EUC0805  [C0805]
C99  10uF  C-EUC0805  [C0805]
C100  1uF  C-EUC0805  [C0805]
C101  10uF  C-EUC0805  [C0805]
C102  1uF  C-EUC0805  [C0805]
C103  10uF  C-EUC0805  [C0805]
C104  1uF  C-EUC0805  [C0805]
C105  10uF  C-EUC0805  [C0805]
C106  1uF  C-EUC0805  [C0805]
C107  10uF  C-EUC0805  [C0805]
C108  1uF  C-EUC0805  [C0805]
C109  10uF  C-EUC0805  [C0805]
C110  1uF  C-EUC0805  [C0805]
C111  10uF  C-EUC0805  [C0805]
C112  1uF  C-EUC0805  [C0805]
C113  10uF  C-EUC0805  [C0805]
C114  1uF  C-EUC0805  [C0805]
C115  10uF  C-EUC0805  [C0805]
C116  1uF  C-EUC0805  [C0805]
C117  10uF  C-EUC0805  [C0805]
C118  1uF  C-EUC0805  [C0805]
C119  10uF  C-EUC0805  [C0805]
C120  1uF  C-EUC0805  [C0805]
C121  10uF  C-EUC0805  [C0805]
C122  1uF  C-EUC0805  [C0805]
C123  10uF  C-EUC0805  [C0805]
C124  1uF  C-EUC0805  [C0805]
C125  10uF  C-EUC0805  [C0805]
C126  1uF  C-EUC0805  [C0805]
C127  10uF  C-EUC0805  [C0805]
C128  1uF  C-EUC0805  [C0805]
C129  10uF  C-EUC0805  [C0805]
C130  1uF  C-EUC0805  [C0805]
C131  10uF  C-EUC0805  [C0805]
C132  1uF  C-EUC0805  [C0805]
C133  10uF  C-EUC0805  [C0805]
C134  1uF  C-EUC0805  [C0805]
C135  10uF  C-EUC0805  [C0805]
C136  1uF  C-EUC0805  [C0805]
C137  10uF  C-EUC0805  [C0805]
C138  1uF  C-EUC0805  [C0805]
C139  10uF  C-EUC0805  [C0805]
C140  1uF  C-EUC0805  [C0805]
C141  10uF  C-EUC0805  [C0805]
C142  1uF  C-EUC0805  [C0805]
C143  10uF  C-EUC0805  [C0805]
C144  1uF  C-EUC0805  [C0805]
C145  10uF  C-EUC0805  [C0805]
C146  1uF  C-EUC0805  [C0805]
C147  10uF  C-EUC0805  [C0805]
C148  1uF  C-EUC0805  [C0805]
C149  10uF  C-EUC0805  [C0805]
C150  1uF  C-EUC0805  [C0805]
C151  10uF  C-EUC0805  [C0805]
C152  1uF  C-EUC0805  [C0805]
C153  10uF  C-EUC0805  [C0805]
C154  1uF  C-EUC0805  [C0805]
C155  10uF  C-EUC0805  [C0805]
C156  1uF  C-EUC0805  [C0805]
C157  10uF  C-EUC0805  [C0805]
C158  1uF  C-EUC0805  [C0805]
C159  10uF  C-EUC0805  [C0805]
C160  1uF  C-EUC0805  [C0805]
C161  10uF  C-EUC0805  [C0805]
C162  1uF  C-EUC0805  [C0805]
C163  10uF  C-EUC0805  [C0805]
C164  1uF  C-EUC0805  [C0805]
C165  10uF  C-EUC0805  [C0805]
C166  1uF  C-EUC0805  [C0805]
C167  10uF  C-EUC0805  [C0805]
C168  1uF  C-EUC0805  [C0805]
C169  10uF  C-EUC0805  [C0805]
C170  1uF  C-EUC0805  [C0805]
C171  10uF  C-EUC0805  [C0805]
C172  1uF  C-EUC0805  [C0805]
C173  10uF  C-EUC0805  [C0805]
C174  1uF  C-EUC0805  [C0805]
C175  10uF  C-EUC0805  [C0805]
C176  1uF  C-EUC0805  [C0805]
C177  10uF  C-EUC0805  [C0805]
C178  1uF  C-EUC0805  [C0805]
C179  10uF  C-EUC0805  [C0805]
C180  1uF  C-EUC0805  [C0805]
C181  10uF  C-EUC0805  [C0805]
C182  1uF  C-EUC0805  [C0805]
C183  10uF  C-EUC0805  [C0805]
C184  1uF  C-EUC0805  [C0805]
C185  10uF  C-EUC0805  [C0805]
C186  1uF  C-EUC0805  [C0805]
C187  10uF  C-EUC0805  [C0805]
C188  1uF  C-EUC0805  [C0805]
C189  10uF  C-EUC0805  [C0805]
C190  1uF  C-EUC0805  [C0805]
C191  10uF  C-EUC0805  [C0805]
C192  1uF  C-EUC0805  [C0805]
R1  2K  R-EU_R0805  [R0805]
R2  2K  R-EU_R0805  [R0805]
R3  2K  R-EU_R0805  [R0805]
R4  2K  R-EU_R0805  [R0805]
R5  2K  R-EU_R0805  [R0805]
R6  2K  R-EU_R0805  [R0805]
R7  2K  R-EU_R0805  [R0805]
R8  2K  R-EU_R0805  [R0805]
R9  2K  R-EU_R0805  [R0805]
R10  2K  R-EU_R0805  [R0805]
R11  2K  R-EU_R0805  [R0805]
R12  2K  R-EU_R0805  [R0805]
R13  2K  R-EU_R0805  [R0805]
R14  2K  R-EU_R0805  [R0805]
R15  2K  R-EU_R0805  [R0805]
R16  2K  R-EU_R0805  [R0805]
R17  2K  R-EU_R0805  [R0805]
R18  2K  R-EU_R0805  [R0805]
R19  2K  R-EU_R0805  [R0805]
R20  2K  R-EU_R0805  [R0805]
R21  2K  R-EU_R0805  [R0805]
R22  2K  R-EU_R0805  [R0805]
R23  2K  R-EU_R0805  [R0805]
R24  2K  R-EU_R0805  [R0805]
R25  2K  R-EU_R0805  [R0805]
R26  2K  R-EU_R0805  [R0805]
R27  2K  R-EU_R0805  [R0805]
R28  2K  R-EU_R0805  [R0805]
R29  2K  R-EU_R0805  [R0805]
R30  2K  R-EU_R0805  [R0805]
R31  2K  R-EU_R0805  [R0805]
R32  2K  R-EU_R0805  [R0805]
R33  2K  R-EU_R0805  [R0805]
R34  2K  R-EU_R0805  [R0805]
R35  2K  R-EU_R0805  [R0805]
R36  2K  R-EU_R0805  [R0805]
R37  2K  R-EU_R0805  [R0805]
R38  2K  R-EU_R0805  [R0805]
R39  2K  R-EU_R0805  [R0805]
R40  2K  R-EU_R0805  [R0805]
R41  2K  R-EU_R0805  [R0805]
R42  2K  R-EU_R0805  [R0805]
R43  2K  R-EU_R0805  [R0805]
R44  2K  R-EU_R0805  [R0805]
R45  2K  R-EU_R0805  [R0805]
R46  2K  R-EU_R0805  [R0805]
R47  2K  R-EU_R0805  [R0805]
R48  2K  R-EU_R0805  [R0805]
R49  2K  R-EU_R0805  [R0805]
R50  2K  R-EU_R0805  [R0805]
R51  2K  R-EU_R0805  [R0805]
R52  2K  R-EU_R0805  [R0805]
R53  2K  R-EU_R0805  [R0805]
R54  2K  R-EU_R0805  [R0805]
R55  2K  R-EU_R0805  [R0805]
R56  2K  R-EU_R0805  [R0805]
R57  2K  R-EU_R0805  [R0805]
R58  2K  R-EU_R0805  [R0805]
R59  2K  R-EU_R0805  [R0805]
R60  2K  R-EU_R0805  [R0805]
R61  2K  R-EU_R0805  [R0805]
R62  2K  R-EU_R0805  [R0805]
R63  2K  R-EU_R0805  [R0805]
R64  2K  R-EU_R0805  [R0805]
R65  2K  R-EU_R0805  [R0805]
R66  2K  R-EU_R0805  [R0805]
R67  2K  R-EU_R0805  [R0805]
R68  2K  R-EU_R0805  [R0805]
R69  2K  R-EU_R0805  [R0805]
R70  2K  R-EU_R0805  [R0805]
R71  2K  R-EU_R0805  [R0805]
R72  2K  R-EU_R0805  [R0805]
R73  2K  R-EU_R0805  [R0805]
R74  2K  R-EU_R0805  [R0805]
R75  2K  R-EU_R0805  [R0805]
R76  2K  R-EU_R0805  [R0805]
R77  2K  R-EU_R0805  [R0805]
R78  2K  R-EU_R0805  [R0805]
R79  2K  R-EU_R0805  [R0805]
R80  2K  R-EU_R0805  [R0805]
R81  2K  R-EU_R0805  [R0805]
R82  2K  R-EU_R0805  [R0805]
R83  2K  R-EU_R0805  [R0805]
R84  2K  R-EU_R0805  [R0805]
R85  2K  R-EU_R0805  [R0805]
R86  2K  R-EU_R0805  [R0805]
R87  2K  R-EU_R0805  [R0805]
R88  2K  R-EU_R0805  [R0805]
R89  2K  R-EU_R0805  [R0805]
R90  2K  R-EU_R0805  [R0805]
R91  2K  R-EU_R0805  [R0805]
R92  2K  R-EU_R0805  [R0805]
R93  2K  R-EU_R0805  [R0805]
R94  2K  R-EU_R0805  [R0805]
R95  2K  R-EU_R0805  [R0805]
R96  2K  R-EU_R0805  [R0805]
SV1  FE20-2  [FE20-2]
SV2  FE20-2  [FE20-2]
SV3  FE20-2  [FE20-2]
SV4  FE20-2  [FE20-2]
SV5  FE20-2  [FE20-2]
SV6  FE20-2  [FE20-2]
SV7  FE20-2  [FE20-2]
SV8  FE20-2  [FE20-2]
U1  DPS310XTSA1  [PG-VLGA-8-1_INF]
U2  SENSIRION_SHT25SENSIRION_SHT25_0_0  [SENSIRION_SHT25_0]
U3  DPS310XTSA1  [PG-VLGA-8-1_INF]
U4  SENSIRION_SHT25SENSIRION_SHT25_0_0  [SENSIRION_SHT25_0]
U5  DPS310XTSA1  [PG-VLGA-8-1_INF]
U6  SENSIRION_SHT25SENSIRION_SHT25_0_0  [SENSIRION_SHT25_0]
U$1  DUT0  MGS  [MGS]
U$2  DUT1  MGS  [MGS]
U$3  DUT2  MGS  [MGS]
U$4  DUT3  MGS  [MGS]
U$5  DUT4  MGS  [MGS]
U$6  DUT5  MGS  [MGS]
U$7  DUT6  MGS  [MGS]
U$8  DUT7  MGS  [MGS]
U$9  DUT8  MGS  [MGS]
U$10  DUT9  MGS  [MGS]
U$11  DUT10  MGS  [MGS]
U$12  DUT11  MGS  [MGS]
U$13  DUT12  MGS  [MGS]
U$14  DUT13  MGS  [MGS]
U$15  DUT14  MGS  [MGS]
U$16  DUT15  MGS  [MGS]
U$17  DUT32  MGS  [MGS]
U$18  DUT33  MGS  [MGS]
U$19  DUT34  MGS  [MGS]
U$20  DUT35  MGS  [MGS]
U$21  DUT36  MGS  [MGS]
U$22  DUT37  MGS  [MGS]
U$23  DUT38  MGS  [MGS]
U$24  DUT39  MGS  [MGS]
U$25  DUT40  MGS  [MGS]
U$26  DUT41  MGS  [MGS]
U$27  DUT42  MGS  [MGS]
U$28  DUT43  MGS  [MGS]
U$29  DUT44  MGS  [MGS]
U$30  DUT45  MGS  [MGS]
U$31  DUT46  MGS  [MGS]
U$32  DUT47  MGS  [MGS]
U$33  DUT64  MGS  [MGS]
U$34  DUT65  MGS  [MGS]
U$35  DUT66  MGS  [MGS]
U$36  DUT67  MGS  [MGS]
U$37  DUT68  MGS  [MGS]
U$38  DUT69  MGS  [MGS]
U$39  DUT70  MGS  [MGS]
U$40  DUT71  MGS  [MGS]
U$41  DUT72  MGS  [MGS]
U$42  DUT73  MGS  [MGS]
U$43  DUT74  MGS  [MGS]
U$44  DUT75  MGS  [MGS]
U$45  DUT76  MGS  [MGS]
U$46  DUT77  MGS  [MGS]
U$47  DUT78  MGS  [MGS]
U$48  DUT79  MGS  [MGS]
U$49  DUT16  MGS  [MGS]
U$50  DUT17  MGS  [MGS]
U$51  DUT18  MGS  [MGS]
U$52  DUT19  MGS  [MGS]
U$53  DUT20  MGS  [MGS]
U$54  DUT21  MGS  [MGS]
U$55  DUT22  MGS  [MGS]
U$56  DUT23  MGS  [MGS]
U$57  DUT24  MGS  [MGS]
U$58  DUT25  MGS  [MGS]
U$59  DUT26  MGS  [MGS]
U$60  DUT27  MGS  [MGS]
U$61  DUT28  MGS  [MGS]
U$62  DUT29  MGS  [MGS]
U$63  DUT30  MGS  [MGS]
U$64  DUT31  MGS  [MGS]
U$65  DUT48  MGS  [MGS]
U$66  DUT49  MGS  [MGS]
U$67  DUT50  MGS  [MGS]
U$68  DUT51  MGS  [MGS]
U$69  DUT52  MGS  [MGS]
U$70  DUT53  MGS  [MGS]
U$71  DUT54  MGS  [MGS]
U$72  DUT55  MGS  [MGS]
U$73  DUT56  MGS  [MGS]
U$74  DUT57  MGS  [MGS]
U$75  DUT58  MGS  [MGS]
U$76  DUT59  MGS  [MGS]
U$77  DUT60  MGS  [MGS]
U$78  DUT61  MGS  [MGS]
U$79  DUT62  MGS  [MGS]
U$80  DUT63  MGS  [MGS]
U$81  DUT80  MGS  [MGS]
U$82  DUT81  MGS  [MGS]
U$83  DUT82  MGS  [MGS]
U$84  DUT83  MGS  [MGS]
U$85  DUT84  MGS  [MGS]
U$86  DUT85  MGS  [MGS]
U$87  DUT86  MGS  [MGS]
U$88  DUT87  MGS  [MGS]
U$89  DUT88  MGS  [MGS]
U$90  DUT89  MGS  [MGS]
U$91  DUT90  MGS  [MGS]
U$92  DUT91  MGS  [MGS]
U$93  DUT92  MGS  [MGS]
U$94  DUT93  MGS  [MGS]
U$95  DUT94  MGS  [MGS]
U$96  DUT95  MGS  [MGS]

## Nets
+12V: C1.1 C3.1 C5.1 C7.1 C9.1 C11.1 C13.1 C15.1 C17.1 C19.1 C21.1 C23.1 C25.1 C27.1 C29.1 C31.1 C33.1 C35.1 C37.1 C39.1 C41.1 C43.1 C45.1 C47.1 C49.1 C51.1 C53.1 C55.1 C57.1 C59.1 C61.1 C63.1 C65.1 C67.1 C69.1 C71.1 C73.1 C75.1 C77.1 C79.1 C81.1 C83.1 C85.1 C87.1 C89.1 C91.1 C93.1 C95.1 C97.1 C99.1 C101.1 C103.1 C105.1 C107.1 C109.1 C111.1 C113.1 C115.1 C117.1 C119.1 C121.1 C123.1 C125.1 C127.1 C129.1 C131.1 C133.1 C135.1 C137.1 C139.1 C141.1 C143.1 C145.1 C147.1 C149.1 C151.1 C153.1 C155.1 C157.1 C159.1 C161.1 C163.1 C165.1 C167.1 C169.1 C171.1 C173.1 C175.1 C177.1 C179.1 C181.1 C183.1 C185.1 C187.1 C189.1 C191.1 SV1.1 SV1.2 SV1.3 SV1.4 SV8.37 SV8.38 SV8.39 SV8.40 U$1.3(VDDH) U$2.3(VDDH) U$3.3(VDDH) U$4.3(VDDH) U$5.3(VDDH) U$6.3(VDDH) U$7.3(VDDH) U$8.3(VDDH) U$9.3(VDDH) U$10.3(VDDH) U$11.3(VDDH) U$12.3(VDDH) U$13.3(VDDH) U$14.3(VDDH) U$15.3(VDDH) U$16.3(VDDH) U$17.3(VDDH) U$18.3(VDDH) U$19.3(VDDH) U$20.3(VDDH) U$21.3(VDDH) U$22.3(VDDH) U$23.3(VDDH) U$24.3(VDDH) U$25.3(VDDH) U$26.3(VDDH) U$27.3(VDDH) U$28.3(VDDH) U$29.3(VDDH) U$30.3(VDDH) U$31.3(VDDH) U$32.3(VDDH) U$33.3(VDDH) U$34.3(VDDH) U$35.3(VDDH) U$36.3(VDDH) U$37.3(VDDH) U$38.3(VDDH) U$39.3(VDDH) U$40.3(VDDH) U$41.3(VDDH) U$42.3(VDDH) U$43.3(VDDH) U$44.3(VDDH) U$45.3(VDDH) U$46.3(VDDH) U$47.3(VDDH) U$48.3(VDDH) U$49.3(VDDH) U$50.3(VDDH) U$51.3(VDDH) U$52.3(VDDH) U$53.3(VDDH) U$54.3(VDDH) U$55.3(VDDH) U$56.3(VDDH) U$57.3(VDDH) U$58.3(VDDH) U$59.3(VDDH) U$60.3(VDDH) U$61.3(VDDH) U$62.3(VDDH) U$63.3(VDDH) U$64.3(VDDH) U$65.3(VDDH) U$66.3(VDDH) U$67.3(VDDH) U$68.3(VDDH) U$69.3(VDDH) U$70.3(VDDH) U$71.3(VDDH) U$72.3(VDDH) U$73.3(VDDH) U$74.3(VDDH) U$75.3(VDDH) U$76.3(VDDH) U$77.3(VDDH) U$78.3(VDDH) U$79.3(VDDH) U$80.3(VDDH) U$81.3(VDDH) U$82.3(VDDH) U$83.3(VDDH) U$84.3(VDDH) U$85.3(VDDH) U$86.3(VDDH) U$87.3(VDDH) U$88.3(VDDH) U$89.3(VDDH) U$90.3(VDDH) U$91.3(VDDH) U$92.3(VDDH) U$93.3(VDDH) U$94.3(VDDH) U$95.3(VDDH) U$96.3(VDDH)
GND: C1.2 C2.2 C3.2 C4.2 C5.2 C6.2 C7.2 C8.2 C9.2 C10.2 C11.2 C12.2 C13.2 C14.2 C15.2 C16.2 C17.2 C18.2 C19.2 C20.2 C21.2 C22.2 C23.2 C24.2 C25.2 C26.2 C27.2 C28.2 C29.2 C30.2 C31.2 C32.2 C33.2 C34.2 C35.2 C36.2 C37.2 C38.2 C39.2 C40.2 C41.2 C42.2 C43.2 C44.2 C45.2 C46.2 C47.2 C48.2 C49.2 C50.2 C51.2 C52.2 C53.2 C54.2 C55.2 C56.2 C57.2 C58.2 C59.2 C60.2 C61.2 C62.2 C63.2 C64.2 C65.2 C66.2 C67.2 C68.2 C69.2 C70.2 C71.2 C72.2 C73.2 C74.2 C75.2 C76.2 C77.2 C78.2 C79.2 C80.2 C81.2 C82.2 C83.2 C84.2 C85.2 C86.2 C87.2 C88.2 C89.2 C90.2 C91.2 C92.2 C93.2 C94.2 C95.2 C96.2 C97.2 C98.2 C99.2 C100.2 C101.2 C102.2 C103.2 C104.2 C105.2 C106.2 C107.2 C108.2 C109.2 C110.2 C111.2 C112.2 C113.2 C114.2 C115.2 C116.2 C117.2 C118.2 C119.2 C120.2 C121.2 C122.2 C123.2 C124.2 C125.2 C126.2 C127.2 C128.2 C129.2 C130.2 C131.2 C132.2 C133.2 C134.2 C135.2 C136.2 C137.2 C138.2 C139.2 C140.2 C141.2 C142.2 C143.2 C144.2 C145.2 C146.2 C147.2 C148.2 C149.2 C150.2 C151.2 C152.2 C153.2 C154.2 C155.2 C156.2 C157.2 C158.2 C159.2 C160.2 C161.2 C162.2 C163.2 C164.2 C165.2 C166.2 C167.2 C168.2 C169.2 C170.2 C171.2 C172.2 C173.2 C174.2 C175.2 C176.2 C177.2 C178.2 C179.2 C180.2 C181.2 C182.2 C183.2 C184.2 C185.2 C186.2 C187.2 C188.2 C189.2 C190.2 C191.2 C192.2 SV1.5 SV1.6 SV1.11 SV1.12 SV1.13 SV1.14 SV1.15 SV1.16 SV2.40 SV3.40 SV4.40 SV5.40 SV6.40 SV7.40 SV8.31 SV8.32 SV8.33 SV8.34 SV8.35 SV8.36 U1.1(GND_2) U1.7(GND) U2.2(VSS) U2.7(VSS_PAD) U3.1(GND_2) U3.7(GND) U4.2(VSS) U4.7(VSS_PAD) U5.1(GND_2) U5.7(GND) U6.2(VSS) U6.7(VSS_PAD) U$1.2(VSS) U$1.10(GND) U$2.2(VSS) U$2.10(GND) U$3.2(VSS) U$3.10(GND) U$4.2(VSS) U$4.10(GND) U$5.2(VSS) U$5.10(GND) U$6.2(VSS) U$6.10(GND) U$7.2(VSS) U$7.10(GND) U$8.2(VSS) U$8.10(GND) U$9.2(VSS) U$9.10(GND) U$10.2(VSS) U$10.10(GND) U$11.2(VSS) U$11.10(GND) U$12.2(VSS) U$12.10(GND) U$13.2(VSS) U$13.10(GND) U$14.2(VSS) U$14.10(GND) U$15.2(VSS) U$15.10(GND) U$16.2(VSS) U$16.10(GND) U$17.2(VSS) U$17.10(GND) U$18.2(VSS) U$18.10(GND) U$19.2(VSS) U$19.10(GND) U$20.2(VSS) U$20.10(GND) U$21.2(VSS) U$21.10(GND) U$22.2(VSS) U$22.10(GND) U$23.2(VSS) U$23.10(GND) U$24.2(VSS) U$24.10(GND) U$25.2(VSS) U$25.10(GND) U$26.2(VSS) U$26.10(GND) U$27.2(VSS) U$27.10(GND) U$28.2(VSS) U$28.10(GND) U$29.2(VSS) U$29.10(GND) U$30.2(VSS) U$30.10(GND) U$31.2(VSS) U$31.10(GND) U$32.2(VSS) U$32.10(GND) U$33.2(VSS) U$33.10(GND) U$34.2(VSS) U$34.10(GND) U$35.2(VSS) U$35.10(GND) U$36.2(VSS) U$36.10(GND) U$37.2(VSS) U$37.10(GND) U$38.2(VSS) U$38.10(GND) U$39.2(VSS) U$39.10(GND) U$40.2(VSS) U$40.10(GND) U$41.2(VSS) U$41.10(GND) U$42.2(VSS) U$42.10(GND) U$43.2(VSS) U$43.10(GND) U$44.2(VSS) U$44.10(GND) U$45.2(VSS) U$45.10(GND) U$46.2(VSS) U$46.10(GND) U$47.2(VSS) U$47.10(GND) U$48.2(VSS) U$48.10(GND) U$49.2(VSS) U$49.10(GND) U$50.2(VSS) U$50.10(GND) U$51.2(VSS) U$51.10(GND) U$52.2(VSS) U$52.10(GND) U$53.2(VSS) U$53.10(GND) U$54.2(VSS) U$54.10(GND) U$55.2(VSS) U$55.10(GND) U$56.2(VSS) U$56.10(GND) U$57.2(VSS) U$57.10(GND) U$58.2(VSS) U$58.10(GND) U$59.2(VSS) U$59.10(GND) U$60.2(VSS) U$60.10(GND) U$61.2(VSS) U$61.10(GND) U$62.2(VSS) U$62.10(GND) U$63.2(VSS) U$63.10(GND) U$64.2(VSS) U$64.10(GND) U$65.2(VSS) U$65.10(GND) U$66.2(VSS) U$66.10(GND) U$67.2(VSS) U$67.10(GND) U$68.2(VSS) U$68.10(GND) U$69.2(VSS) U$69.10(GND) U$70.2(VSS) U$70.10(GND) U$71.2(VSS) U$71.10(GND) U$72.2(VSS) U$72.10(GND) U$73.2(VSS) U$73.10(GND) U$74.2(VSS) U$74.10(GND) U$75.2(VSS) U$75.10(GND) U$76.2(VSS) U$76.10(GND) U$77.2(VSS) U$77.10(GND) U$78.2(VSS) U$78.10(GND) U$79.2(VSS) U$79.10(GND) U$80.2(VSS) U$80.10(GND) U$81.2(VSS) U$81.10(GND) U$82.2(VSS) U$82.10(GND) U$83.2(VSS) U$83.10(GND) U$84.2(VSS) U$84.10(GND) U$85.2(VSS) U$85.10(GND) U$86.2(VSS) U$86.10(GND) U$87.2(VSS) U$87.10(GND) U$88.2(VSS) U$88.10(GND) U$89.2(VSS) U$89.10(GND) U$90.2(VSS) U$90.10(GND) U$91.2(VSS) U$91.10(GND) U$92.2(VSS) U$92.10(GND) U$93.2(VSS) U$93.10(GND) U$94.2(VSS) U$94.10(GND) U$95.2(VSS) U$95.10(GND) U$96.2(VSS) U$96.10(GND)
INT0: SV1.21 U$1.9(INT)
INT1: SV1.22 U$2.9(INT)
INT2: SV1.27 U$3.9(INT)
INT3: SV1.28 U$4.9(INT)
INT4: SV1.33 U$5.9(INT)
INT5: SV1.34 U$6.9(INT)
INT6: SV1.39 U$7.9(INT)
INT7: SV1.40 U$8.9(INT)
INT8: SV2.5 U$9.9(INT)
INT9: SV2.6 U$10.9(INT)
INT10: SV2.11 U$11.9(INT)
INT11: SV2.12 U$12.9(INT)
INT12: SV2.17 U$13.9(INT)
INT13: SV2.18 U$14.9(INT)
INT14: SV2.23 U$15.9(INT)
INT15: SV2.24 U$16.9(INT)
INT16: SV5.6 U$49.9(INT)
INT17: SV5.11 U$50.9(INT)
INT18: SV5.12 U$51.9(INT)
INT19: SV5.17 U$52.9(INT)
INT20: SV5.18 U$53.9(INT)
INT21: SV5.23 U$54.9(INT)
INT22: SV5.24 U$55.9(INT)
INT23: SV5.29 U$56.9(INT)
INT24: SV5.30 U$57.9(INT)
INT25: SV5.35 U$58.9(INT)
INT26: SV5.36 U$59.9(INT)
INT27: SV5.38 U$60.9(INT)
INT28: SV6.5 U$61.9(INT)
INT29: SV6.6 U$62.9(INT)
INT30: SV6.11 U$63.9(INT)
INT31: SV6.12 U$64.9(INT)
INT32: SV2.29 U$17.9(INT)
INT33: SV2.30 U$18.9(INT)
INT34: SV2.35 U$19.9(INT)
INT35: SV2.36 U$20.9(INT)
INT36: SV2.38 U$21.9(INT)
INT37: SV3.5 U$22.9(INT)
INT38: SV3.6 U$23.9(INT)
INT39: SV3.11 U$24.9(INT)
INT40: SV3.12 U$25.9(INT)
INT41: SV3.17 U$26.9(INT)
INT42: SV3.18 U$27.9(INT)
INT43: SV3.23 U$28.9(INT)
INT44: SV3.24 U$29.9(INT)
INT45: SV3.29 U$30.9(INT)
INT46: SV3.30 U$31.9(INT)
INT47: SV3.35 U$32.9(INT)
INT48: SV6.17 U$65.9(INT)
INT49: SV6.18 U$66.9(INT)
INT50: SV6.23 U$67.9(INT)
INT51: SV6.24 U$68.9(INT)
INT52: SV6.29 U$69.9(INT)
INT53: SV6.30 U$70.9(INT)
INT54: SV6.35 U$71.9(INT)
INT55: SV6.36 U$72.9(INT)
INT56: SV6.38 U$73.9(INT)
INT57: SV7.5 U$74.9(INT)
INT58: SV7.6 U$75.9(INT)
INT59: SV7.11 U$76.9(INT)
INT60: SV7.12 U$77.9(INT)
INT61: SV7.17 U$78.9(INT)
INT62: SV7.18 U$79.9(INT)
INT63: SV7.23 U$80.9(INT)
INT64: SV3.36 U$33.9(INT)
INT65: SV3.38 U$34.9(INT)
INT66: SV4.5 U$35.9(INT)
INT67: SV4.6 U$36.9(INT)
INT68: SV4.11 U$37.9(INT)
INT69: SV4.12 U$38.9(INT)
INT70: SV4.17 U$39.9(INT)
INT71: SV4.18 U$40.9(INT)
INT72: SV4.23 U$41.9(INT)
INT73: SV4.24 U$42.9(INT)
INT74: SV4.29 U$43.9(INT)
INT75: SV4.30 U$44.9(INT)
INT76: SV4.35 U$45.9(INT)
INT77: SV4.36 U$46.9(INT)
INT78: SV4.38 U$47.9(INT)
INT79: SV5.5 U$48.9(INT)
INT80: SV7.24 U$81.9(INT)
INT81: SV7.29 U$82.9(INT)
INT82: SV7.30 U$83.9(INT)
INT83: SV7.35 U$84.9(INT)
INT84: SV7.36 U$85.9(INT)
INT85: SV7.38 U$86.9(INT)
INT86: SV8.5 U$87.9(INT)
INT87: SV8.6 U$88.9(INT)
INT88: SV8.11 U$89.9(INT)
INT89: SV8.12 U$90.9(INT)
INT90: SV8.17 U$91.9(INT)
INT91: SV8.18 U$92.9(INT)
INT92: SV8.23 U$93.9(INT)
INT93: SV8.24 U$94.9(INT)
INT94: SV8.29 U$95.9(INT)
INT95: SV8.30 U$96.9(INT)
N$1: R1.2 U$1.5(EXT_IN)
N$2: R1.1 U$1.6(EXT_OUT)
N$3: R2.2 U$2.5(EXT_IN)
N$4: R2.1 U$2.6(EXT_OUT)
N$5: R3.2 U$3.5(EXT_IN)
N$6: R3.1 U$3.6(EXT_OUT)
N$7: R4.2 U$4.5(EXT_IN)
N$8: R4.1 U$4.6(EXT_OUT)
N$9: R5.2 U$5.5(EXT_IN)
N$10: R5.1 U$5.6(EXT_OUT)
N$11: R6.2 U$6.5(EXT_IN)
N$12: R6.1 U$6.6(EXT_OUT)
N$13: R7.2 U$7.5(EXT_IN)
N$14: R7.1 U$7.6(EXT_OUT)
N$15: R8.2 U$8.5(EXT_IN)
N$16: R8.1 U$8.6(EXT_OUT)
N$17: R9.2 U$9.5(EXT_IN)
N$18: R9.1 U$9.6(EXT_OUT)
N$19: R10.2 U$10.5(EXT_IN)
N$20: R10.1 U$10.6(EXT_OUT)
N$21: R11.2 U$11.5(EXT_IN)
N$22: R11.1 U$11.6(EXT_OUT)
N$23: R12.2 U$12.5(EXT_IN)
N$24: R12.1 U$12.6(EXT_OUT)
N$25: R13.2 U$13.5(EXT_IN)
N$26: R13.1 U$13.6(EXT_OUT)
N$27: R14.2 U$14.5(EXT_IN)
N$28: R14.1 U$14.6(EXT_OUT)
N$29: R15.2 U$15.5(EXT_IN)
N$30: R15.1 U$15.6(EXT_OUT)
N$31: R16.2 U$16.5(EXT_IN)
N$32: R16.1 U$16.6(EXT_OUT)
N$33: R17.2 U$17.5(EXT_IN)
N$34: R17.1 U$17.6(EXT_OUT)
N$35: R18.2 U$18.5(EXT_IN)
N$36: R18.1 U$18.6(EXT_OUT)
N$37: R19.2 U$19.5(EXT_IN)
N$38: R19.1 U$19.6(EXT_OUT)
N$39: R20.2 U$20.5(EXT_IN)
N$40: R20.1 U$20.6(EXT_OUT)
N$41: R21.2 U$21.5(EXT_IN)
N$42: R21.1 U$21.6(EXT_OUT)
N$43: R22.2 U$22.5(EXT_IN)
N$44: R22.1 U$22.6(EXT_OUT)
N$45: R23.2 U$23.5(EXT_IN)
N$46: R23.1 U$23.6(EXT_OUT)
N$47: R24.2 U$24.5(EXT_IN)
N$48: R24.1 U$24.6(EXT_OUT)
N$49: R25.2 U$25.5(EXT_IN)
N$50: R25.1 U$25.6(EXT_OUT)
N$51: R26.2 U$26.5(EXT_IN)
N$52: R26.1 U$26.6(EXT_OUT)
N$53: R27.2 U$27.5(EXT_IN)
N$54: R27.1 U$27.6(EXT_OUT)
N$55: R28.2 U$28.5(EXT_IN)
N$56: R28.1 U$28.6(EXT_OUT)
N$57: R29.2 U$29.5(EXT_IN)
N$58: R29.1 U$29.6(EXT_OUT)
N$59: R30.2 U$30.5(EXT_IN)
N$60: R30.1 U$30.6(EXT_OUT)
N$61: R31.2 U$31.5(EXT_IN)
N$62: R31.1 U$31.6(EXT_OUT)
N$63: R32.2 U$32.5(EXT_IN)
N$64: R32.1 U$32.6(EXT_OUT)
N$65: R33.2 U$33.5(EXT_IN)
N$66: R33.1 U$33.6(EXT_OUT)
N$67: R34.2 U$34.5(EXT_IN)
N$68: R34.1 U$34.6(EXT_OUT)
N$69: R35.2 U$35.5(EXT_IN)
N$70: R35.1 U$35.6(EXT_OUT)
N$71: R36.2 U$36.5(EXT_IN)
N$72: R36.1 U$36.6(EXT_OUT)
N$73: R37.2 U$37.5(EXT_IN)
N$74: R37.1 U$37.6(EXT_OUT)
N$75: R38.2 U$38.5(EXT_IN)
N$76: R38.1 U$38.6(EXT_OUT)
N$77: R39.2 U$39.5(EXT_IN)
N$78: R39.1 U$39.6(EXT_OUT)
N$79: R40.2 U$40.5(EXT_IN)
N$80: R40.1 U$40.6(EXT_OUT)
N$81: R41.2 U$41.5(EXT_IN)
N$82: R41.1 U$41.6(EXT_OUT)
N$83: R42.2 U$42.5(EXT_IN)
N$84: R42.1 U$42.6(EXT_OUT)
N$85: R43.2 U$43.5(EXT_IN)
N$86: R43.1 U$43.6(EXT_OUT)
N$87: R44.2 U$44.5(EXT_IN)
N$88: R44.1 U$44.6(EXT_OUT)
N$89: R45.2 U$45.5(EXT_IN)
N$90: R45.1 U$45.6(EXT_OUT)
N$91: R46.2 U$46.5(EXT_IN)
N$92: R46.1 U$46.6(EXT_OUT)
N$93: R47.2 U$47.5(EXT_IN)
N$94: R47.1 U$47.6(EXT_OUT)
N$95: R48.2 U$48.5(EXT_IN)
N$96: R48.1 U$48.6(EXT_OUT)
N$97: R49.2 U$49.5(EXT_IN)
N$98: R49.1 U$49.6(EXT_OUT)
N$99: R50.2 U$50.5(EXT_IN)
N$100: R50.1 U$50.6(EXT_OUT)
N$101: R51.2 U$51.5(EXT_IN)
N$102: R51.1 U$51.6(EXT_OUT)
N$103: R52.2 U$52.5(EXT_IN)
N$104: R52.1 U$52.6(EXT_OUT)
N$105: R53.2 U$53.5(EXT_IN)
N$106: R53.1 U$53.6(EXT_OUT)
N$107: R54.2 U$54.5(EXT_IN)
N$108: R54.1 U$54.6(EXT_OUT)
N$109: R55.2 U$55.5(EXT_IN)
N$110: R55.1 U$55.6(EXT_OUT)
N$111: R56.2 U$56.5(EXT_IN)
N$112: R56.1 U$56.6(EXT_OUT)
N$113: R57.2 U$57.5(EXT_IN)
N$114: R57.1 U$57.6(EXT_OUT)
N$115: R58.2 U$58.5(EXT_IN)
N$116: R58.1 U$58.6(EXT_OUT)
N$117: R59.2 U$59.5(EXT_IN)
N$118: R59.1 U$59.6(EXT_OUT)
N$119: R60.2 U$60.5(EXT_IN)
N$120: R60.1 U$60.6(EXT_OUT)
N$121: R61.2 U$61.5(EXT_IN)
N$122: R61.1 U$61.6(EXT_OUT)
N$123: R62.2 U$62.5(EXT_IN)
N$124: R62.1 U$62.6(EXT_OUT)
N$125: R63.2 U$63.5(EXT_IN)
N$126: R63.1 U$63.6(EXT_OUT)
N$127: R64.2 U$64.5(EXT_IN)
N$128: R64.1 U$64.6(EXT_OUT)
N$129: R65.2 U$65.5(EXT_IN)
N$130: R65.1 U$65.6(EXT_OUT)
N$131: R66.2 U$66.5(EXT_IN)
N$132: R66.1 U$66.6(EXT_OUT)
N$133: R67.2 U$67.5(EXT_IN)
N$134: R67.1 U$67.6(EXT_OUT)
N$135: R68.2 U$68.5(EXT_IN)
N$136: R68.1 U$68.6(EXT_OUT)
N$137: R69.2 U$69.5(EXT_IN)
N$138: R69.1 U$69.6(EXT_OUT)
N$139: R70.2 U$70.5(EXT_IN)
N$140: R70.1 U$70.6(EXT_OUT)
N$141: R71.2 U$71.5(EXT_IN)
N$142: R71.1 U$71.6(EXT_OUT)
N$143: R72.2 U$72.5(EXT_IN)
N$144: R72.1 U$72.6(EXT_OUT)
N$145: R73.2 U$73.5(EXT_IN)
N$146: R73.1 U$73.6(EXT_OUT)
N$147: R74.2 U$74.5(EXT_IN)
N$148: R74.1 U$74.6(EXT_OUT)
N$149: R75.2 U$75.5(EXT_IN)
N$150: R75.1 U$75.6(EXT_OUT)
N$151: R76.2 U$76.5(EXT_IN)
N$152: R76.1 U$76.6(EXT_OUT)
N$153: R77.2 U$77.5(EXT_IN)
N$154: R77.1 U$77.6(EXT_OUT)
N$155: R78.2 U$78.5(EXT_IN)
N$156: R78.1 U$78.6(EXT_OUT)
N$157: R79.2 U$79.5(EXT_IN)
N$158: R79.1 U$79.6(EXT_OUT)
N$159: R80.2 U$80.5(EXT_IN)
N$160: R80.1 U$80.6(EXT_OUT)
N$161: R81.2 U$81.5(EXT_IN)
N$162: R81.1 U$81.6(EXT_OUT)
N$163: R82.2 U$82.5(EXT_IN)
N$164: R82.1 U$82.6(EXT_OUT)
N$165: R83.2 U$83.5(EXT_IN)
N$166: R83.1 U$83.6(EXT_OUT)
N$167: R84.2 U$84.5(EXT_IN)
N$168: R84.1 U$84.6(EXT_OUT)
N$169: R85.2 U$85.5(EXT_IN)
N$170: R85.1 U$85.6(EXT_OUT)
N$171: R86.2 U$86.5(EXT_IN)
N$172: R86.1 U$86.6(EXT_OUT)
N$173: R87.2 U$87.5(EXT_IN)
N$174: R87.1 U$87.6(EXT_OUT)
N$175: R88.2 U$88.5(EXT_IN)
N$176: R88.1 U$88.6(EXT_OUT)
N$177: R89.2 U$89.5(EXT_IN)
N$178: R89.1 U$89.6(EXT_OUT)
N$179: R90.2 U$90.5(EXT_IN)
N$180: R90.1 U$90.6(EXT_OUT)
N$181: R91.2 U$91.5(EXT_IN)
N$182: R91.1 U$91.6(EXT_OUT)
N$183: R92.2 U$92.5(EXT_IN)
N$184: R92.1 U$92.6(EXT_OUT)
N$185: R93.2 U$93.5(EXT_IN)
N$186: R93.1 U$93.6(EXT_OUT)
N$187: R94.2 U$94.5(EXT_IN)
N$188: R94.1 U$94.6(EXT_OUT)
N$189: R95.2 U$95.5(EXT_IN)
N$190: R95.1 U$95.6(EXT_OUT)
N$191: R96.2 U$96.5(EXT_IN)
N$192: R96.1 U$96.6(EXT_OUT)
SCL0: SV1.17 U$1.7(SCL)
SCL1: SV1.18 U$2.7(SCL)
SCL2: SV1.23 U$3.7(SCL)
SCL3: SV1.24 U$4.7(SCL)
SCL4: SV1.29 U$5.7(SCL)
SCL5: SV1.30 U$6.7(SCL)
SCL6: SV1.35 U$7.7(SCL)
SCL7: SV1.36 U$8.7(SCL)
SCL8: SV2.1 U$9.7(SCL)
SCL9: SV2.2 U$10.7(SCL)
SCL10: SV2.7 U$11.7(SCL)
SCL11: SV2.8 U$12.7(SCL)
SCL12: SV2.13 U$13.7(SCL)
SCL13: SV2.14 U$14.7(SCL)
SCL14: SV2.19 U$15.7(SCL)
SCL15: SV2.20 U$16.7(SCL)
SCL16: SV5.2 U$49.7(SCL)
SCL17: SV5.7 U$50.7(SCL)
SCL18: SV5.8 U$51.7(SCL)
SCL19: SV5.13 U$52.7(SCL)
SCL20: SV5.14 U$53.7(SCL)
SCL21: SV5.19 U$54.7(SCL)
SCL22: SV5.20 U$55.7(SCL)
SCL23: SV5.25 U$56.7(SCL)
SCL24: SV5.26 U$57.7(SCL)
SCL25: SV5.31 U$58.7(SCL)
SCL26: SV5.32 U$59.7(SCL)
SCL27: SV5.37 U$60.7(SCL)
SCL28: SV6.1 U$61.7(SCL)
SCL29: SV6.2 U$62.7(SCL)
SCL30: SV6.7 U$63.7(SCL)
SCL31: SV6.8 U1.4(SCK) U2.6(SCL) U$64.7(SCL)
SCL32: SV2.25 U$17.7(SCL)
SCL33: SV2.26 U$18.7(SCL)
SCL34: SV2.31 U$19.7(SCL)
SCL35: SV2.32 U$20.7(SCL)
SCL36: SV2.37 U$21.7(SCL)
SCL37: SV3.1 U$22.7(SCL)
SCL38: SV3.2 U$23.7(SCL)
SCL39: SV3.7 U$24.7(SCL)
SCL40: SV3.8 U$25.7(SCL)
SCL41: SV3.13 U$26.7(SCL)
SCL42: SV3.14 U$27.7(SCL)
SCL43: SV3.19 U$28.7(SCL)
SCL44: SV3.20 U$29.7(SCL)
SCL45: SV3.25 U$30.7(SCL)
SCL46: SV3.26 U$31.7(SCL)
SCL47: SV3.31 U$32.7(SCL)
SCL48: SV6.13 U$65.7(SCL)
SCL49: SV6.14 U$66.7(SCL)
SCL50: SV6.19 U$67.7(SCL)
SCL51: SV6.20 U$68.7(SCL)
SCL52: SV6.25 U$69.7(SCL)
SCL53: SV6.26 U$70.7(SCL)
SCL54: SV6.31 U$71.7(SCL)
SCL55: SV6.32 U$72.7(SCL)
SCL56: SV6.37 U$73.7(SCL)
SCL57: SV7.1 U$74.7(SCL)
SCL58: SV7.2 U$75.7(SCL)
SCL59: SV7.7 U$76.7(SCL)
SCL60: SV7.8 U$77.7(SCL)
SCL61: SV7.13 U$78.7(SCL)
SCL62: SV7.14 U$79.7(SCL)
SCL63: SV7.19 U3.4(SCK) U4.6(SCL) U$80.7(SCL)
SCL64: SV3.32 U$33.7(SCL)
SCL65: SV3.37 U$34.7(SCL)
SCL66: SV4.1 U$35.7(SCL)
SCL67: SV4.2 U$36.7(SCL)
SCL68: SV4.7 U$37.7(SCL)
SCL69: SV4.8 U$38.7(SCL)
SCL70: SV4.13 U$39.7(SCL)
SCL71: SV4.14 U$40.7(SCL)
SCL72: SV4.19 U$41.7(SCL)
SCL73: SV4.20 U$42.7(SCL)
SCL74: SV4.25 U$43.7(SCL)
SCL75: SV4.26 U$44.7(SCL)
SCL76: SV4.31 U$45.7(SCL)
SCL77: SV4.32 U$46.7(SCL)
SCL78: SV4.37 U$47.7(SCL)
SCL79: SV5.1 U$48.7(SCL)
SCL80: SV7.20 U$81.7(SCL)
SCL81: SV7.25 U$82.7(SCL)
SCL82: SV7.26 U$83.7(SCL)
SCL83: SV7.31 U$84.7(SCL)
SCL84: SV7.32 U$85.7(SCL)
SCL85: SV7.37 U$86.7(SCL)
SCL86: SV8.1 U$87.7(SCL)
SCL87: SV8.2 U$88.7(SCL)
SCL88: SV8.7 U$89.7(SCL)
SCL89: SV8.8 U$90.7(SCL)
SCL90: SV8.13 U$91.7(SCL)
SCL91: SV8.14 U$92.7(SCL)
SCL92: SV8.19 U$93.7(SCL)
SCL93: SV8.20 U$94.7(SCL)
SCL94: SV8.25 U$95.7(SCL)
SCL95: SV8.26 U5.4(SCK) U6.6(SCL) U$96.7(SCL)
SDA0: SV1.19 U$1.8(SDA)
SDA1: SV1.20 U$2.8(SDA)
SDA2: SV1.25 U$3.8(SDA)
SDA3: SV1.26 U$4.8(SDA)
SDA4: SV1.31 U$5.8(SDA)
SDA5: SV1.32 U$6.8(SDA)
SDA6: SV1.37 U$7.8(SDA)
SDA7: SV1.38 U$8.8(SDA)
SDA8: SV2.3 U$9.8(SDA)
SDA9: SV2.4 U$10.8(SDA)
SDA10: SV2.9 U$11.8(SDA)
SDA11: SV2.10 U$12.8(SDA)
SDA12: SV2.15 U$13.8(SDA)
SDA13: SV2.16 U$14.8(SDA)
SDA14: SV2.21 U$15.8(SDA)
SDA15: SV2.22 U$16.8(SDA)
SDA16: SV5.4 U$49.8(SDA)
SDA17: SV5.9 U$50.8(SDA)
SDA18: SV5.10 U$51.8(SDA)
SDA19: SV5.15 U$52.8(SDA)
SDA20: SV5.16 U$53.8(SDA)
SDA21: SV5.21 U$54.8(SDA)
SDA22: SV5.22 U$55.8(SDA)
SDA23: SV5.27 U$56.8(SDA)
SDA24: SV5.28 U$57.8(SDA)
SDA25: SV5.33 U$58.8(SDA)
SDA26: SV5.34 U$59.8(SDA)
SDA27: SV5.39 U$60.8(SDA)
SDA28: SV6.3 U$61.8(SDA)
SDA29: SV6.4 U$62.8(SDA)
SDA30: SV6.9 U$63.8(SDA)
SDA31: SV6.10 U1.3(SDI) U2.1(SDA) U$64.8(SDA)
SDA32: SV2.27 U$17.8(SDA)
SDA33: SV2.28 U$18.8(SDA)
SDA34: SV2.33 U$19.8(SDA)
SDA35: SV2.34 U$20.8(SDA)
SDA36: SV2.39 U$21.8(SDA)
SDA37: SV3.3 U$22.8(SDA)
SDA38: SV3.4 U$23.8(SDA)
SDA39: SV3.9 U$24.8(SDA)
SDA40: SV3.10 U$25.8(SDA)
SDA41: SV3.15 U$26.8(SDA)
SDA42: SV3.16 U$27.8(SDA)
SDA43: SV3.21 U$28.8(SDA)
SDA44: SV3.22 U$29.8(SDA)
SDA45: SV3.27 U$30.8(SDA)
SDA46: SV3.28 U$31.8(SDA)
SDA47: SV3.33 U$32.8(SDA)
SDA48: SV6.15 U$65.8(SDA)
SDA49: SV6.16 U$66.8(SDA)
SDA50: SV6.21 U$67.8(SDA)
SDA51: SV6.22 U$68.8(SDA)
SDA52: SV6.27 U$69.8(SDA)
SDA53: SV6.28 U$70.8(SDA)
SDA54: SV6.33 U$71.8(SDA)
SDA55: SV6.34 U$72.8(SDA)
SDA56: SV6.39 U$73.8(SDA)
SDA57: SV7.3 U$74.8(SDA)
SDA58: SV7.4 U$75.8(SDA)
SDA59: SV7.9 U$76.8(SDA)
SDA60: SV7.10 U$77.8(SDA)
SDA61: SV7.15 U$78.8(SDA)
SDA62: SV7.16 U$79.8(SDA)
SDA63: SV7.21 U3.3(SDI) U4.1(SDA) U$80.8(SDA)
SDA64: SV3.34 U$33.8(SDA)
SDA65: SV3.39 U$34.8(SDA)
SDA66: SV4.3 U$35.8(SDA)
SDA67: SV4.4 U$36.8(SDA)
SDA68: SV4.9 U$37.8(SDA)
SDA69: SV4.10 U$38.8(SDA)
SDA70: SV4.15 U$39.8(SDA)
SDA71: SV4.16 U$40.8(SDA)
SDA72: SV4.21 U$41.8(SDA)
SDA73: SV4.22 U$42.8(SDA)
SDA74: SV4.27 U$43.8(SDA)
SDA75: SV4.28 U$44.8(SDA)
SDA76: SV4.33 U$45.8(SDA)
SDA77: SV4.34 U$46.8(SDA)
SDA78: SV4.39 U$47.8(SDA)
SDA79: SV5.3 U$48.8(SDA)
SDA80: SV7.22 U$81.8(SDA)
SDA81: SV7.27 U$82.8(SDA)
SDA82: SV7.28 U$83.8(SDA)
SDA83: SV7.33 U$84.8(SDA)
SDA84: SV7.34 U$85.8(SDA)
SDA85: SV7.39 U$86.8(SDA)
SDA86: SV8.3 U$87.8(SDA)
SDA87: SV8.4 U$88.8(SDA)
SDA88: SV8.9 U$89.8(SDA)
SDA89: SV8.10 U$90.8(SDA)
SDA90: SV8.15 U$91.8(SDA)
SDA91: SV8.16 U$92.8(SDA)
SDA92: SV8.21 U$93.8(SDA)
SDA93: SV8.22 U$94.8(SDA)
SDA94: SV8.27 U$95.8(SDA)
SDA95: SV8.28 U5.3(SDI) U6.1(SDA) U$96.8(SDA)
VDD: C2.1 C4.1 C6.1 C8.1 C10.1 C12.1 C14.1 C16.1 C18.1 C20.1 C22.1 C24.1 C26.1 C28.1 C30.1 C32.1 C34.1 C36.1 C38.1 C40.1 C42.1 C44.1 C46.1 C48.1 C50.1 C52.1 C54.1 C56.1 C58.1 C60.1 C62.1 C64.1 C66.1 C68.1 C70.1 C72.1 C74.1 C76.1 C78.1 C80.1 C82.1 C84.1 C86.1 C88.1 C90.1 C92.1 C94.1 C96.1 C98.1 C100.1 C102.1 C104.1 C106.1 C108.1 C110.1 C112.1 C114.1 C116.1 C118.1 C120.1 C122.1 C124.1 C126.1 C128.1 C130.1 C132.1 C134.1 C136.1 C138.1 C140.1 C142.1 C144.1 C146.1 C148.1 C150.1 C152.1 C154.1 C156.1 C158.1 C160.1 C162.1 C164.1 C166.1 C168.1 C170.1 C172.1 C174.1 C176.1 C178.1 C180.1 C182.1 C184.1 C186.1 C188.1 C190.1 C192.1 SV1.7 SV1.8 SV1.9 SV1.10 U1.6(VDDIO) U1.8(VDD) U2.5(VDD) U3.6(VDDIO) U3.8(VDD) U4.5(VDD) U5.6(VDDIO) U5.8(VDD) U6.5(VDD) U$1.1(VDD) U$1.4(VDD_IO) U$2.1(VDD) U$2.4(VDD_IO) U$3.1(VDD) U$3.4(VDD_IO) U$4.1(VDD) U$4.4(VDD_IO) U$5.1(VDD) U$5.4(VDD_IO) U$6.1(VDD) U$6.4(VDD_IO) U$7.1(VDD) U$7.4(VDD_IO) U$8.1(VDD) U$8.4(VDD_IO) U$9.1(VDD) U$9.4(VDD_IO) U$10.1(VDD) U$10.4(VDD_IO) U$11.1(VDD) U$11.4(VDD_IO) U$12.1(VDD) U$12.4(VDD_IO) U$13.1(VDD) U$13.4(VDD_IO) U$14.1(VDD) U$14.4(VDD_IO) U$15.1(VDD) U$15.4(VDD_IO) U$16.1(VDD) U$16.4(VDD_IO) U$17.1(VDD) U$17.4(VDD_IO) U$18.1(VDD) U$18.4(VDD_IO) U$19.1(VDD) U$19.4(VDD_IO) U$20.1(VDD) U$20.4(VDD_IO) U$21.1(VDD) U$21.4(VDD_IO) U$22.1(VDD) U$22.4(VDD_IO) U$23.1(VDD) U$23.4(VDD_IO) U$24.1(VDD) U$24.4(VDD_IO) U$25.1(VDD) U$25.4(VDD_IO) U$26.1(VDD) U$26.4(VDD_IO) U$27.1(VDD) U$27.4(VDD_IO) U$28.1(VDD) U$28.4(VDD_IO) U$29.1(VDD) U$29.4(VDD_IO) U$30.1(VDD) U$30.4(VDD_IO) U$31.1(VDD) U$31.4(VDD_IO) U$32.1(VDD) U$32.4(VDD_IO) U$33.1(VDD) U$33.4(VDD_IO) U$34.1(VDD) U$34.4(VDD_IO) U$35.1(VDD) U$35.4(VDD_IO) U$36.1(VDD) U$36.4(VDD_IO) U$37.1(VDD) U$37.4(VDD_IO) U$38.1(VDD) U$38.4(VDD_IO) U$39.1(VDD) U$39.4(VDD_IO) U$40.1(VDD) U$40.4(VDD_IO) U$41.1(VDD) U$41.4(VDD_IO) U$42.1(VDD) U$42.4(VDD_IO) U$43.1(VDD) U$43.4(VDD_IO) U$44.1(VDD) U$44.4(VDD_IO) U$45.1(VDD) U$45.4(VDD_IO) U$46.1(VDD) U$46.4(VDD_IO) U$47.1(VDD) U$47.4(VDD_IO) U$48.1(VDD) U$48.4(VDD_IO) U$49.1(VDD) U$49.4(VDD_IO) U$50.1(VDD) U$50.4(VDD_IO) U$51.1(VDD) U$51.4(VDD_IO) U$52.1(VDD) U$52.4(VDD_IO) U$53.1(VDD) U$53.4(VDD_IO) U$54.1(VDD) U$54.4(VDD_IO) U$55.1(VDD) U$55.4(VDD_IO) U$56.1(VDD) U$56.4(VDD_IO) U$57.1(VDD) U$57.4(VDD_IO) U$58.1(VDD) U$58.4(VDD_IO) U$59.1(VDD) U$59.4(VDD_IO) U$60.1(VDD) U$60.4(VDD_IO) U$61.1(VDD) U$61.4(VDD_IO) U$62.1(VDD) U$62.4(VDD_IO) U$63.1(VDD) U$63.4(VDD_IO) U$64.1(VDD) U$64.4(VDD_IO) U$65.1(VDD) U$65.4(VDD_IO) U$66.1(VDD) U$66.4(VDD_IO) U$67.1(VDD) U$67.4(VDD_IO) U$68.1(VDD) U$68.4(VDD_IO) U$69.1(VDD) U$69.4(VDD_IO) U$70.1(VDD) U$70.4(VDD_IO) U$71.1(VDD) U$71.4(VDD_IO) U$72.1(VDD) U$72.4(VDD_IO) U$73.1(VDD) U$73.4(VDD_IO) U$74.1(VDD) U$74.4(VDD_IO) U$75.1(VDD) U$75.4(VDD_IO) U$76.1(VDD) U$76.4(VDD_IO) U$77.1(VDD) U$77.4(VDD_IO) U$78.1(VDD) U$78.4(VDD_IO) U$79.1(VDD) U$79.4(VDD_IO) U$80.1(VDD) U$80.4(VDD_IO) U$81.1(VDD) U$81.4(VDD_IO) U$82.1(VDD) U$82.4(VDD_IO) U$83.1(VDD) U$83.4(VDD_IO) U$84.1(VDD) U$84.4(VDD_IO) U$85.1(VDD) U$85.4(VDD_IO) U$86.1(VDD) U$86.4(VDD_IO) U$87.1(VDD) U$87.4(VDD_IO) U$88.1(VDD) U$88.4(VDD_IO) U$89.1(VDD) U$89.4(VDD_IO) U$90.1(VDD) U$90.4(VDD_IO) U$91.1(VDD) U$91.4(VDD_IO) U$92.1(VDD) U$92.4(VDD_IO) U$93.1(VDD) U$93.4(VDD_IO) U$94.1(VDD) U$94.4(VDD_IO) U$95.1(VDD) U$95.4(VDD_IO) U$96.1(VDD) U$96.4(VDD_IO)
Unconnected: U1.2(CSB) U1.5(SDO) U2.3(1_NC) U2.4(2_NC) U3.2(CSB) U3.5(SDO) U4.3(1_NC) U4.4(2_NC) U5.2(CSB) U5.5(SDO) U6.3(1_NC) U6.4(2_NC)

## Notes on the sheet
- DUT0 | DUT1 | DUT2 | DUT3 | DUT4 | DUT5 | DUT6 | DUT7
- DUT8 | DUT9 | DUT10 | DUT11 | DUT12 | DUT13 | DUT14 | DUT15
- DUT32 | DUT33 | DUT34 | DUT35 | DUT36 | DUT37 | DUT38 | DUT39
- DUT40 | DUT41 | DUT42 | DUT43 | DUT44 | DUT45 | DUT46 | DUT47
- DUT64 | DUT65 | DUT66 | DUT67 | DUT68 | DUT69 | DUT70 | DUT71
- DUT72 | DUT73 | DUT74 | DUT75 | DUT76 | DUT77 | DUT78 | DUT79
- DUT16 | DUT17 | DUT18 | DUT19 | DUT20 | DUT21 | DUT22 | DUT23
- DUT24 | DUT25 | DUT26 | DUT27 | DUT28 | DUT29 | DUT30 | DUT31
- DUT48 | DUT49 | DUT50 | DUT51 | DUT52 | DUT53 | DUT54 | DUT55
- DUT56 | DUT57 | DUT58 | DUT59 | DUT60 | DUT61 | DUT62 | DUT63
- DUT80 | DUT81 | DUT82 | DUT83 | DUT84 | DUT85 | DUT86 | DUT87
- DUT88 | DUT89 | DUT90 | DUT91 | DUT92 | DUT93 | DUT94 | DUT95

## Library data of the parts
C1-C192 = rcl:C-EU: CAPACITOR, European symbol; SPICEPREFIX: C
R1-R96 = rcl:R-EU_: RESISTOR, European symbol; SPICEPREFIX: R
SV1-SV8 = con-lsta:FE20-2: FEMALE HEADER; OC_FARNELL: unknown; OC_NEWARK: unknown
U1 U3 U5 = DPS310:DPS310XTSA1; BUILT_BY: EMA_Kyle; COPYRIGHT: Copyright (C) 2018 Accelerated Designs. All rights reserved; MANUFACTURER_PART_NUMBER: DPS310XTSA1; SOURCELIBRARY: Infineon_Sample_2019-08-29; VENDOR: Infineon
U2 U4 U6 = Sensirion - SHT25:SENSIRION_SHT25: Humidity and Temperature Sensor IC; CENTROID_NOT_SPECIFIED: No; DATASHEET: https://www.sensirion.com/fileadmin/user_upload/customers/sensirion/Dokumente/2_Humidity_Sensors/Sensirion_Humidity_Sensors_SHT25_Datasheet.pdf; DIGIKEY_DESCRIPTION: IC Humidity Temperature Sensor 0 ~ 100% RH I²C ±1.8% RH 8s Surface Mount; DIGIKEY_PART_NUMBER: 1649-1008-1-ND; LEAD_FREE: yes; MF: Sensirion; MOUSER_PART_NUMBER: 403-SHT25; MPN: SHT25; PACKAGE: DFN6; PREFIX: U; ROHS: yes; TEMPERATURE_RANGE_HIGH: +125°C; TEMPERATURE_RANGE_LOW: -40°C
U$1-U$96 = MGS:MGS